# Altium project Archim_0.4.PrjPcb (part 1 of 3)
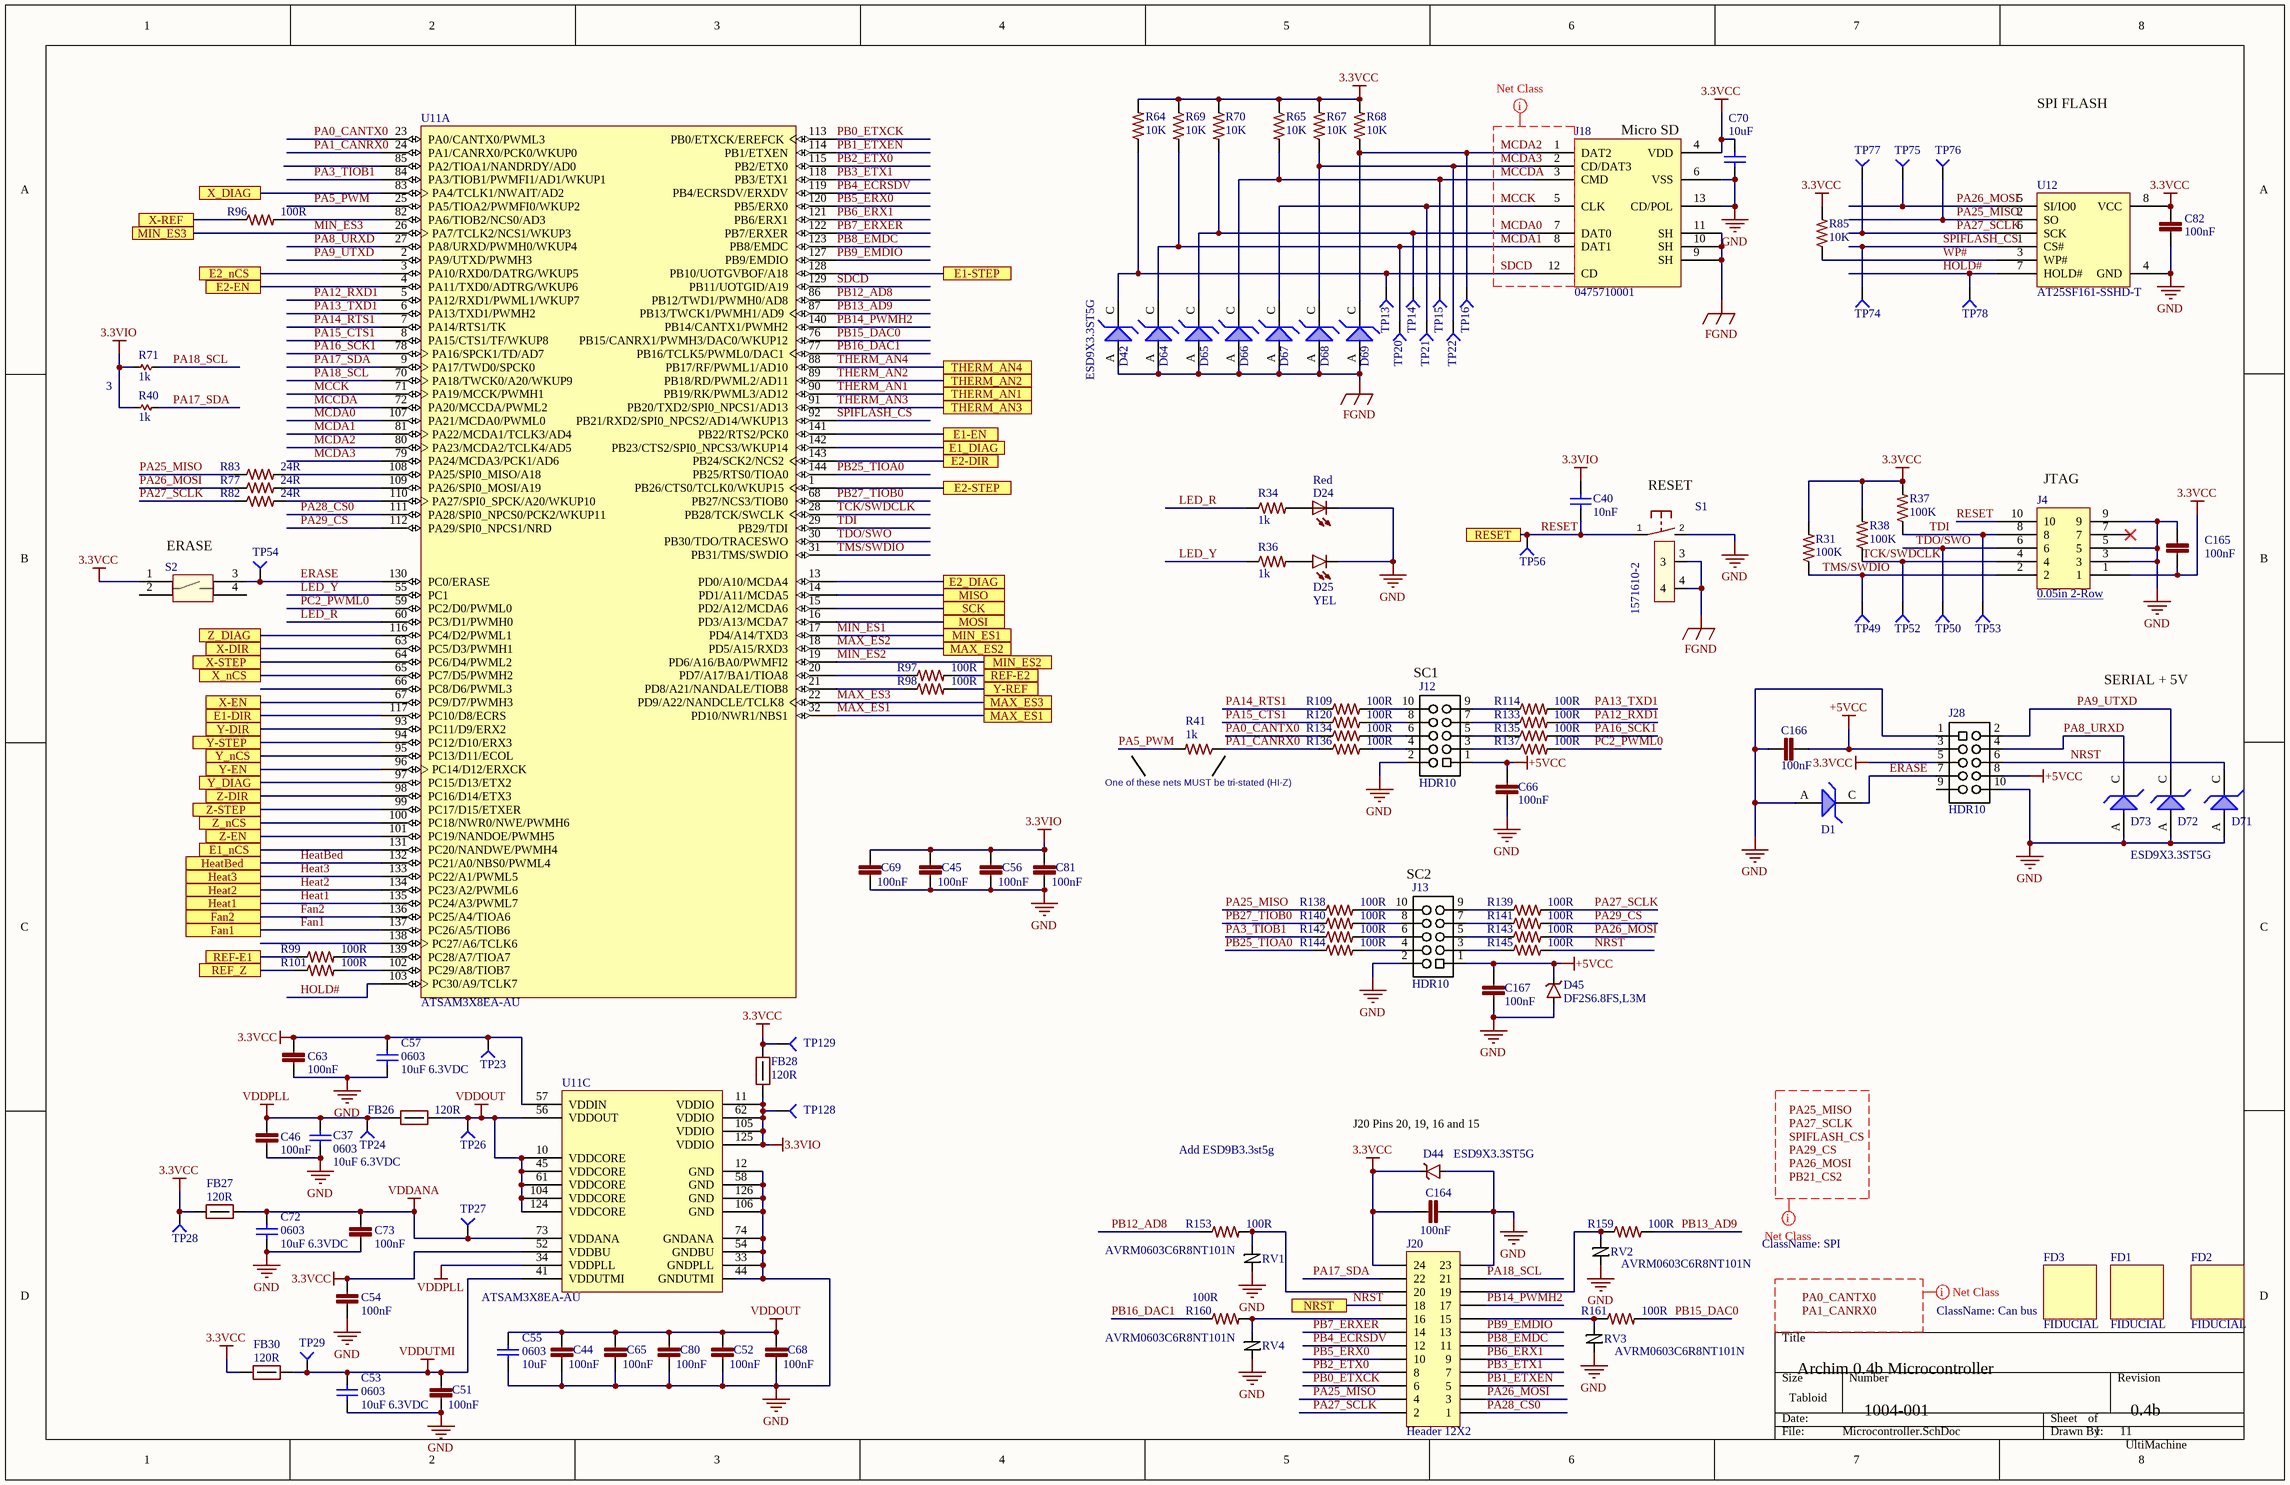
[diagram p0: Microcontroller.SchDoc]
projectDesigner: UltiMachine; projectDocumentNumber: 1004-001; projectDocumentRevision: 0.4b; projectTitle: Archim; projectVersion: 0.4b
11 sheets, 690 parts. Net scope: flat (ports and power ports of the same name join across sheets).
Board file: Archim.PcbDoc
Sheets:
  Microcontroller.SchDoc
  Power.SchDoc
  USB.SchDoc
  EndStops.SchDoc
  Motor-X.SchDoc
  Motor-Y.SchDoc
  Motor-Z.SchDoc
  Motor-E1.SchDoc
  Motor-E2.SchDoc
  Thermistors.SchDoc
  Mosfets.SchDoc

## Sheet Microcontroller.SchDoc: Microcontroller
size Tabloid; DocumentNumber: 1; Revision: 0.4b; SheetNumber: 1; SheetTotal: 11

### Parts
(Parts that share a designator on the sheet are numbered #1, #2 ... from top to bottom, then left to right.)
C37  0603  value 10uF 6.3VDC  [C0603]
C40  10nF  [C0402]
C44  100nF  [C0402]
C45  100nF  [C0402]
C46  100nF  [C0402]
C51  100nF  [C0402]
C52  100nF  [C0402]
C53  0603  value 10uF 6.3VDC  [C0603]
C54  100nF  [C0402]
C55  0603  value 10uF  [C0603]
C56  100nF  [C0402]
C57  0603  value 10uF 6.3VDC  [C0603]
C63  100nF  [C0402]
C65  100nF  [C0402]
C66  100nF  [C0402]
C68  100nF  [C0402]
C69  100nF  [C0402]
C70  value 10uF  [C0603]  (hidden comment: 0603)
C72  0603  value 10uF 6.3VDC  [C0603]
C73  100nF  [C0402]
C80  100nF  [C0402]
C81  100nF  [C0402]
C82  100nF  [C0402]
C164  100nF  [C0402]
C165  100nF  [C0402]
C166  100nF  [C0402]
C167  100nF  [C0402]
D1  ESD9X3.3ST5G  [SOD923-100X40-2N]  (value not drawn)
D24  Red  [LED2012120]
D25  YEL  [LED2012120]
D42  ESD9X3.3ST5G  [SOD923-100X40-2N]
D44  ESD9X3.3ST5G  [SOD923-D]
D45  DF2S6.8FS,L3M  [SOD923-D]
D64  ESD9X3.3ST5G  [SOD923-100X40-2N]  (value not drawn)
D65  ESD9X3.3ST5G  [SOD923-100X40-2N]  (value not drawn)
D66  ESD9X3.3ST5G  [SOD923-100X40-2N]  (value not drawn)
D67  ESD9X3.3ST5G  [SOD923-100X40-2N]  (value not drawn)
D68  ESD9X3.3ST5G  [SOD923-100X40-2N]  (value not drawn)
D69  ESD9X3.3ST5G  [SOD923-100X40-2N]  (value not drawn)
D71  ESD9X3.3ST5G  [SOD923-100X40-2N]
D72  ESD9X3.3ST5G  [SOD923-100X40-2N]  (value not drawn)
D73  ESD9X3.3ST5G  [SOD923-100X40-2N]  (value not drawn)
FB26  120R  [FB0603]
FB27  120R  [FB0603]
FB28  120R  [FB0603]
FB30  120R  [FB0603]
FD1  FIDUCIAL  [FIDUCIAL-1X2]
FD2  FIDUCIAL  [FIDUCIAL-1X2]
FD3  FIDUCIAL  [FIDUCIAL-1X2]
J4  0.05in 2-Row  [FTSH-105-XX-X-DV]
J12  HDR10  [HDR2X5 IDC]
J13  HDR10  [HDR2X5 IDC]
J18  0475710001  [SD_MICRO 475710001]
J20  Header 12X2  [HDR2X12]
J28  HDR10  [HDR2X5 IDC]
R31  100K  [R0402]
R34  1k  [R0402]
R36  1k  [R0402]
R37  100K  [R0402]
R38  100K  [R0402]
R40  1k  [R0402]
R41  1k  [R0402]
R64  10K  [R0402]
R65  10K  [R0402]
R67  10K  [R0402]
R68  10K  [R0402]
R69  10K  [R0402]
R70  10K  [R0402]
R71  1k  [R0402]
R77  24R  [R0402]
R82  24R  [R0402]
R83  24R  [R0402]
R85  10K  [R0402]
R96  100R  [R0402]
R97  100R  [R0402]
R98  100R  [R0402]
R99  100R  [R0402]
R101  100R  [R0402]
R109  100R  [R0402]
R114  100R  [R0402]
R120  100R  [R0402]
R133  100R  [R0402]
R134  100R  [R0402]
R135  100R  [R0402]
R136  100R  [R0402]
R137  100R  [R0402]
R138  100R  [R0402]
R139  100R  [R0402]
R140  100R  [R0402]
R141  100R  [R0402]
R142  100R  [R0402]
R143  100R  [R0402]
R144  100R  [R0402]
R145  100R  [R0402]
R153  100R  [R0402]
R159  100R  [R0402]
R160  100R  [R0402]
R161  100R  [R0402]
RV1  AVRM0603C6R8NT101N  [C0201 Large Pads]
RV2  AVRM0603C6R8NT101N  [C0201 Large Pads]
RV3  AVRM0603C6R8NT101N  [C0201 Large Pads]
RV4  AVRM0603C6R8NT101N  [C0201 Large Pads]
S1  1571610-2  [B3F-31XX]
S2  KMR741NG ULC LFS  [KMR 6 Series]  (value not drawn)
TP13  TP4  [TP-2]  (value not drawn)  (no BOM)
TP14  TP4  [TP-2]  (value not drawn)  (no BOM)
TP15  TP4  [TP-2]  (value not drawn)  (no BOM)
TP16  TP4  [TP-2]  (value not drawn)  (no BOM)
TP20  TP4  [TP-2]  (value not drawn)  (no BOM)
TP21  TP4  [TP-2]  (value not drawn)  (no BOM)
TP22  TP4  [TP-2]  (value not drawn)  (no BOM)
TP23  TP4  [TP-2]  (value not drawn)  (no BOM)
TP24  TP4  [TP-2]  (value not drawn)  (no BOM)
TP26  TP4  [TP-2]  (value not drawn)  (no BOM)
TP27  TP4  [TP-2]  (value not drawn)  (no BOM)
TP28  TP4  [TP-2]  (value not drawn)  (no BOM)
TP29  TP4  [TP-2]  (value not drawn)  (no BOM)
TP49  TP4  [TP-2]  (value not drawn)  (no BOM)
TP50  TP4  [TP-2]  (value not drawn)  (no BOM)
TP52  TP4  [TP-2]  (value not drawn)  (no BOM)
TP53  TP4  [TP-2]  (value not drawn)  (no BOM)
TP54  TP4  [TP-2]  (value not drawn)  (no BOM)
TP56  TP4  [TP-2]  (value not drawn)  (no BOM)
TP74  TP4  [TP-2]  (value not drawn)  (no BOM)
TP75  TP4  [TP-2]  (value not drawn)  (no BOM)
TP76  TP4  [TP-2]  (value not drawn)  (no BOM)
TP77  TP4  [TP-2]  (value not drawn)  (no BOM)
TP78  TP4  [TP-2]  (value not drawn)  (no BOM)
TP128  TP4  [TP-2]  (value not drawn)  (no BOM)
TP129  TP4  [TP-2]  (value not drawn)  (no BOM)
U11#1  ATSAM3X8EA-AU  [LQFP144_N]  (part A of 3)
U11#2  ATSAM3X8EA-AU  [LQFP144_N]  (part C of 3)
U12  AT25SF161-SSHD-T  [S25FL216K0PMFI041]

### Ports
E1-DIR, E1-EN, E1-STEP, E1_DIAG, E1_nCS, E2-DIR, E2-EN, E2-STEP, E2_DIAG, E2_nCS, Fan1, Fan2, Heat1, Heat2, Heat3, HeatBed, MAX_ES1, MAX_ES2, MAX_ES3, MIN_ES1, MIN_ES2, MIN_ES3, MISO, MOSI, NRST, REF-E1, REF-E2, REF_Z, RESET, SCK, THERM_AN1, THERM_AN2, THERM_AN3, THERM_AN4, X-DIR, X-EN, X-REF, X-STEP, X_DIAG, X_nCS, Y-DIR, Y-EN, Y-REF, Y-STEP, Y_DIAG, Y_nCS, Z-DIR, Z-EN, Z-STEP, Z_DIAG, Z_nCS

### Nets
3.3VCC: C54.1 C57.2 C63.1 C70.2 C82.1 C164.1 C165.2 D44.K FB27.1 FB28.2 FB30.1 J4.1 J18.4(VDD) J20.24 J28.5 R31.2 R37.2 R38.2 R64.2 R65.1 R67.2 R68.2 R69.1 R70.1 R85.2 S2.1 TP23.1 TP28.1 TP129.1 U11#2.52(VDDBU) U11#2.57(VDDIN) U12.8(VCC)
3.3VIO: C40.2 C45.1 C56.1 C69.1 C81.1 FB28.1 R40.1 R71.1 TP128.1 U11#2.11(VDDIO) U11#2.62(VDDIO) U11#2.105(VDDIO) U11#2.125(VDDIO)
+5VCC: C66.2 C166.1 C167.2 D45.K J12.1 J13.1 J28.3 J28.8
FGND: D42.A D64.A D65.A D66.A D67.A D68.A D69.A J18.9(SH) J18.10(SH) J18.11(SH) S1.3 S1.4
GND: C37.1 C44.2 C45.2 C46.2 C51.2 C52.2 C53.1 C54.2 C55.1 C56.2 C57.1 C63.2 C65.2 C66.1 C68.2 C69.2 C70.1 C72.1 C73.2 C80.2 C81.2 C82.2 C164.2 C165.1 C166.2 C167.1 D1.A D24.C D25.C D44.A D45.A D71.A D72.A D73.A J4.3 J4.5 J4.9 J12.2 J13.2 J18.6(VSS) J18.13(CD/POL) J20.23 J28.1 J28.10 RV1.2 RV2.2 RV3.2 RV4.2 S1.2(S) U11#2.12(GND) U11#2.33(GNDPLL) U11#2.44(GNDUTMI) U11#2.54(GNDBU) U11#2.58(GND) U11#2.74(GNDANA) U11#2.106(GND) U11#2.126(GND) U12.4(GND)
VDDANA: C72.2 C73.1 FB27.2 TP27.1 U11#2.73(VDDANA)
VDDOUT: C44.1 C52.1 C55.2 C65.1 C68.1 C80.1 FB26.2 TP26.1 U11#2.10(VDDCORE) U11#2.45(VDDCORE) U11#2.56(VDDOUT) U11#2.61(VDDCORE) U11#2.104(VDDCORE) U11#2.124(VDDCORE)
VDDPLL: C37.2 C46.1 FB26.1 TP24.1 U11#2.34(VDDPLL)
VDDUTMI: C51.1 C53.2 FB30.2 TP29.1 U11#2.41(VDDUTMI)
E1-DIR: U11#1.117(PC10/D8/ECRS) ; port E1-DIR
E1-EN: U11#1.141(PB22/RTS2/PCK0) ; port E1-EN
E1-STEP: U11#1.128(PB10/UOTGVBOF/A18) ; port E1-STEP
E1_DIAG: U11#1.142(PB23/CTS2/SPI0_NPCS3/WKUP14) ; port E1_DIAG
E1_nCS: U11#1.131(PC20/NANDWE/PWMH4) ; port E1_nCS
E2-DIR: U11#1.143(PB24/SCK2/NCS2) ; port E2-DIR
E2-EN: U11#1.4(PA11/TXD0/ADTRG/WKUP6) ; port E2-EN
E2-STEP: U11#1.1(PB26/CTS0/TCLK0/WKUP15) ; port E2-STEP
E2_DIAG: U11#1.13(PD0/A10/MCDA4) ; port E2_DIAG
E2_nCS: U11#1.3(PA10/RXD0/DATRG/WKUP5) ; port E2_nCS
ERASE: D1.C J28.7 S2.3 TP54.1 U11#1.130(PC0/ERASE)
Fan1: U11#1.137(PC26/A5/TIOB6) ; port Fan1
Fan2: U11#1.136(PC25/A4/TIOA6) ; port Fan2
Heat1: U11#1.135(PC24/A3/PWML7) ; port Heat1
Heat2: U11#1.134(PC23/A2/PWML6) ; port Heat2
Heat3: U11#1.133(PC22/A1/PWML5) ; port Heat3
HeatBed: U11#1.132(PC21/A0/NBS0/PWML4) ; port HeatBed
HOLD#: TP78.1 U11#1.103(PC30/A9/TCLK7) U12.7(HOLD#)
LED_R: R34.1 U11#1.60(PC3/D1/PWMH0)
LED_Y: R36.1 U11#1.55(PC1)
MAX_ES1: U11#1.32(PD10/NWR1/NBS1) ; port MAX_ES1
MAX_ES2: U11#1.18(PD5/A15/RXD3) ; port MAX_ES2
MAX_ES3: U11#1.22(PD9/A22/NANDCLE/TCLK8) ; port MAX_ES3
MCCDA: D66.C J18.3(CMD) R65.2 TP15.1 U11#1.72(PA20/MCCDA/PWML2)
MCCK: D67.C J18.5(CLK) TP21.1 U11#1.71(PA19/MCCK/PWMH1)
MCDA0: D65.C J18.7(DAT0) R70.2 TP14.1 U11#1.107(PA21/MCDA0/PWML0)
MCDA1: D64.C J18.8(DAT1) R69.2 TP20.1 U11#1.81(PA22/MCDA1/TCLK3/AD4)
MCDA2: D69.C J18.1(DAT2) R68.1 TP16.1 U11#1.80(PA23/MCDA2/TCLK4/AD5)
MCDA3: D68.C J18.2(CD/DAT3) R67.1 TP22.1 U11#1.79(PA24/MCDA3/PCK1/AD6)
MIN_ES1: U11#1.17(PD4/A14/TXD3) ; port MIN_ES1
MIN_ES2: U11#1.19(PD6/A16/BA0/PWMFI2) ; port MIN_ES2
MIN_ES3: U11#1.26(PA7/TCLK2/NCS1/WKUP3) ; port MIN_ES3
MISO: U11#1.14(PD1/A11/MCDA5) ; port MISO
MOSI: U11#1.16(PD3/A13/MCDA7) ; port MOSI
NRST: D71.C J20.18 J28.6 R145.2 ; port NRST
PA0_CANTX0: R134.1 U11#1.23(PA0/CANTX0/PWML3)
PA1_CANRX0: R41.1 R136.1 U11#1.24(PA1/CANRX0/PCK0/WKUP0)
PA3_TIOB1: R142.1 U11#1.84(PA3/TIOB1/PWMFI1/AD1/WKUP1)
PA5_PWM: R41.2 U11#1.25(PA5/TIOA2/PWMFI0/WKUP2)
PA8_URXD: D73.C J28.4 U11#1.27(PA8/URXD/PWMH0/WKUP4)
PA9_UTXD: D72.C J28.2 U11#1.2(PA9/UTXD/PWMH3)
PA12_RXD1: R133.2 U11#1.5(PA12/RXD1/PWML1/WKUP7)
PA13_TXD1: R114.2 U11#1.6(PA13/TXD1/PWMH2)
PA14_RTS1: R109.1 U11#1.7(PA14/RTS1/TK)
PA15_CTS1: R120.1 U11#1.8(PA15/CTS1/TF/WKUP8)
PA16_SCK1: R135.2 U11#1.78(PA16/SPCK1/TD/AD7)
PA17_SDA: J20.22 R40.2 U11#1.9(PA17/TWD0/SPCK0)
PA18_SCL: J20.21 R71.2 U11#1.70(PA18/TWCK0/A20/WKUP9)
PA25_MISO: J20.4 R83.1 R138.1 TP76.1 U12.2(SO)
PA26_MOSI: J20.3 R77.1 R143.2 TP75.1 U12.5(SI/IO0)
PA27_SCLK: J20.2 R82.1 R139.2 TP77.1 U12.6(SCK)
PA28_CS0: J20.1 U11#1.111(PA28/SPI0_NPCS0/PCK2/WKUP11)
PA29_CS: R141.2 U11#1.112(PA29/SPI0_NPCS1/NRD)
PB0_ETXCK: J20.6 U11#1.113(PB0/ETXCK/EREFCK)
PB1_ETXEN: J20.5 U11#1.114(PB1/ETXEN)
PB2_ETX0: J20.8 U11#1.115(PB2/ETX0)
PB3_ETX1: J20.7 U11#1.118(PB3/ETX1)
PB4_ECRSDV: J20.12 U11#1.119(PB4/ECRSDV/ERXDV)
PB5_ERX0: J20.10 U11#1.120(PB5/ERX0)
PB6_ERX1: J20.9 U11#1.121(PB6/ERX1)
PB7_ERXER: J20.14 U11#1.122(PB7/ERXER)
PB8_EMDC: J20.11 U11#1.123(PB8/EMDC)
PB9_EMDIO: J20.13 U11#1.127(PB9/EMDIO)
PB12_AD8: R153.1 U11#1.86(PB12/TWD1/PWMH0/AD8)
PB13_AD9: R159.2 U11#1.87(PB13/TWCK1/PWMH1/AD9)
PB14_PWMH2: J20.17 U11#1.140(PB14/CANTX1/PWMH2)
PB15_DAC0: R161.2 U11#1.76(PB15/CANRX1/PWMH3/DAC0/WKUP12)
PB16_DAC1: R160.1 U11#1.77(PB16/TCLK5/PWML0/DAC1)
PB25_TIOA0: R144.1 U11#1.144(PB25/RTS0/TIOA0)
PB27_TIOB0: R140.1 U11#1.68(PB27/NCS3/TIOB0)
PC2_PWML0: R137.2 U11#1.59(PC2/D0/PWML0)
REF-E1: R99.1 ; port REF-E1
REF-E2: R97.2 ; port REF-E2
REF_Z: R101.1 ; port REF_Z
RESET: C40.1 J4.10 S1.1(P) TP56.1 ; port RESET
SCK: U11#1.15(PD2/A12/MCDA6) ; port SCK
SDCD: D42.C J18.12(CD) R64.1 TP13.1 U11#1.129(PB11/UOTGID/A19)
SPIFLASH_CS: TP74.1 U11#1.92(PB21/RXD2/SPI0_NPCS2/AD14/WKUP13) U12.1(CS#)
TCK/SWDCLK: J4.4 R38.1 TP52.1 U11#1.28(PB28/TCK/SWCLK)
TDI: J4.8 R37.1 TP53.1 U11#1.29(PB29/TDI)
TDO/SWO: J4.6 TP50.1 U11#1.30(PB30/TDO/TRACESWO)
THERM_AN1: U11#1.90(PB19/RK/PWML3/AD12) ; port THERM_AN1
THERM_AN2: U11#1.89(PB18/RD/PWML2/AD11) ; port THERM_AN2
THERM_AN3: U11#1.91(PB20/TXD2/SPI0_NPCS1/AD13) ; port THERM_AN3
THERM_AN4: U11#1.88(PB17/RF/PWML1/AD10) ; port THERM_AN4
TMS/SWDIO: J4.2 R31.1 TP49.1 U11#1.31(PB31/TMS/SWDIO)
WP#: R85.1 U12.3(WP#)
X-DIR: U11#1.63(PC5/D3/PWMH1) ; port X-DIR
X-EN: U11#1.67(PC9/D7/PWMH3) ; port X-EN
X-REF: R96.1 ; port X-REF
X-STEP: U11#1.64(PC6/D4/PWML2) ; port X-STEP
X_DIAG: U11#1.83(PA4/TCLK1/NWAIT/AD2) ; port X_DIAG
X_nCS: U11#1.65(PC7/D5/PWMH2) ; port X_nCS
Y-DIR: U11#1.93(PC11/D9/ERX2) ; port Y-DIR
Y-EN: U11#1.96(PC14/D12/ERXCK) ; port Y-EN
Y-REF: R98.2 ; port Y-REF
Y-STEP: U11#1.94(PC12/D10/ERX3) ; port Y-STEP
Y_DIAG: U11#1.97(PC15/D13/ETX2) ; port Y_DIAG
Y_nCS: U11#1.95(PC13/D11/ECOL) ; port Y_nCS
Z-DIR: U11#1.98(PC16/D14/ETX3) ; port Z-DIR
Z-EN: U11#1.101(PC19/NANDOE/PWMH5) ; port Z-EN
Z-STEP: U11#1.99(PC17/D15/ETXER) ; port Z-STEP
Z_DIAG: U11#1.116(PC4/D2/PWML1) ; port Z_DIAG
Z_nCS: U11#1.100(PC18/NWR0/NWE/PWMH6) ; port Z_nCS
NetD24_A: D24.A R34.2
NetD25_A: D25.A R36.2
NetJ12_3: J12.3 R137.1
NetJ12_4: J12.4 R136.2
NetJ12_5: J12.5 R135.1
NetJ12_6: J12.6 R134.2
NetJ12_7: J12.7 R133.1
NetJ12_8: J12.8 R120.2
NetJ12_9: J12.9 R114.1
NetJ12_10: J12.10 R109.2
NetJ13_3: J13.3 R145.1
NetJ13_4: J13.4 R144.2
NetJ13_5: J13.5 R143.1
NetJ13_6: J13.6 R142.2
NetJ13_7: J13.7 R141.1
NetJ13_8: J13.8 R140.2
NetJ13_9: J13.9 R139.1
NetJ13_10: J13.10 R138.2
NetJ20_15: J20.15 R161.1 RV3.1
NetJ20_16: J20.16 R160.2 RV4.1
NetJ20_19: J20.19 R159.1 RV2.1
NetJ20_20: J20.20 R153.2 RV1.1
NetR77_2: R77.2 U11#1.109(PA26/SPI0_MOSI/A19)
NetR82_2: R82.2 U11#1.110(PA27/SPI0_SPCK/A20/WKUP10)
NetR83_2: R83.2 U11#1.108(PA25/SPI0_MISO/A18)
NetR96_2: R96.2 U11#1.82(PA6/TIOB2/NCS0/AD3)
NetR97_1: R97.1 U11#1.20(PD7/A17/BA1/TIOA8)
NetR98_1: R98.1 U11#1.21(PD8/A21/NANDALE/TIOB8)
NetR99_2: R99.2 U11#1.139(PC28/A7/TIOA7)
NetR101_2: R101.2 U11#1.102(PC29/A8/TIOB7)

Not connected (* = marked no-connect by the designer): J4 7*; J28 9; S2 2 4; U11#1 66(PC8/D6/PWML3) 85(PA2/TIOA1/NANDRDY/AD0) 138(PC27/A6/TCLK6)

### Layout directives
net class SD: MCCDA, MCCK, MCDA0, MCDA1, MCDA2, MCDA3, SDCD
net class Can bus: PA0_CANTX0, PA1_CANRX0
net class SPI: PA25_MISO, PA26_MOSI, PA27_SCLK, PA29_CS, PB21_CS2, SPIFLASH_CS

### Notes on the sheet
- (near J18) Micro SD
- SPI FLASH
- 3
- (near S1) RESET
- (near J4) JTAG
- (near S2) ERASE
- (near J12) SC1
- SERIAL + 5V
- One of these nets MUST be tri-stated (HI-Z)
- (near J13) SC2
- Add ESD9B3.3st5g
- (near D44) J20 Pins 20, 19, 16 and 15
- Labels drawn without touching a wire or pin: PA0_CANTX0, PA1_CANRX0, PA25_MISO, PA26_MOSI, PA27_SCLK, PA29_CS, PB21_CS2, SPIFLASH_CS

### Library data of the parts
C37 C53 C55 C57 C70 C72 = C1608JB0J106K080AB: CAP CER 10UF 6.3V 10% JB 0603; MANUFACTURER: TDK; PART: 10µF ±10% 6.3V Ceramic Capacitor JB 0603 (1608 Metric); EE_SPEC: 6.3VDC; PART DESCRIPTION: CAP CER 10UF 6.3V 10% JB 0603; TOLERANCE: 10%; MANUFACTURER #: C1608JB0J106K080AB; DISTRIBUTOR #: 445-11185-1-ND; DISTRIBUTOR: Digi-Key Electronics
C40 = GRM155R71H103JA88D: CAP CER 10nF 50V X7R 0402; PART DESCRIPTION: 10000pF ±5% 50V Ceramic Capacitor X7R 0402 (1005 Metric); MANUFACTURER: Murata; TOLERANCE: 5%; EE_SPEC: 50V; VALUE: 10nF; MANUFACTURER #: GRM155R71H103JA88D; DISTRIBUTOR #: 490-7763-1-ND; DISTRIBUTOR: Digi-Key Electronics; PART: 10nF 50V X7R 0402
C44-C46 C51 C52 C54 C56 C63 C65 C66 C68 C69 C73 C80-C82 C164-C167 = GRM155R71C104KA88D: CAP CER 0402 100nF 16V 10% X7R; MANUFACTURER: Murata; PART: 0.1uF 16V X7R 0402; PART DESCRIPTION: 0.10µF ±10% 16V Ceramic Capacitor X7R 0402 (1005 Metric); EE_SPEC: 100nF 16V X7R 0402; VALUE: 100nF; MANUFACTURER #: GRM155R71C104KA88D; DISTRIBUTOR #: 490-3261-2-ND; DISTRIBUTOR: Digi-Key Electronics; TOLERANCE: 10%
D1 D42 D44 D64-D69 D71-D73 = ESD9X3.3ST5G: TVS DIODE 3.3VWM 10.4VC SOD923; MANUFACTURER: On Semi; PART: TVS DIODE 3.3VWM SOD923; TOLERANCE: -NA-; VALUE: 3.3V; EE_SPEC: 3.3Vso 15pF; MANUFACTURER #: ESD9X3.3ST5G; DISTRIBUTOR #: ESD9X3.3ST5GOSCT-ND; PART DESCRIPTION: TVS DIODE 3.3VWM SOD923
  D1 D42 D64-D69 D71-D73: DISTRIBUTOR: Digi-Key Electronics
  D44: DISTRIBUTOR: Digikey
D24 = 5988110107F: LED 0805 Red; MANUFACTURER: Dialight; PART: LED Red 0805; PART DESCRIPTION: Red 635nm LED Indication - Discrete 2.2V 0805 (2012 Metric); TOLERANCE: -NA-; EE_SPEC: Vf=2.2V; VALUE: Red; MANUFACTURER #: 5988110107F; DISTRIBUTOR #: 350-2038-2-ND; DISTRIBUTOR: Digi-Key Electronics
D25 = 5988140107F: LED 0805 Yellow; MANUFACTURER: Dialight; PART: LED Yellow 0805; PART DESCRIPTION: Yellow 593nm LED Indication - Discrete 2V 0805 (2012 Metric); TOLERANCE: -NA-; EE_SPEC: Vf=2V; VALUE: YEL; MANUFACTURER #: 5988140107F; DISTRIBUTOR #: 350-2041-2-ND; DISTRIBUTOR: Digi-Key Electronics
D45 = DF2S6.8FS,L3M: TVS DIODE 5V 9V SOD923; MANUFACTURER: Toshiba; EE_SPEC: 5Vso; MANUFACTURER #: DF2S6.8FS,L3M; PART DESCRIPTION: TVS DIODE 5V 9V SOD923; VALUE: 5V
FB26-FB28 FB30 = FERRITE 120R 3A 0603: FERRITE BEAD 120 OHM 0603 1LN; MANUFACTURER: Samsung; MANUFACTURER #: CIS10P121AC; MANUFACTURER2#: 490-5254-2-ND; VALUE: 120Rfb; TOLERANCE: -NA-; EE_SPEC: 3A; DISTRIBUTOR #: 1276-6351-2-ND; DISTRIBUTOR: Digi-Key Electronics; PART: FERRITE 120R 3A 0603; PART DESCRIPTION: FERRITE BEAD 120 OHM 0603 1LN
FD1-FD3 = FIDUCIAL: MANUFACTURER #: NOTAPART-Fiducial
J4 = ARM Cortex JTAG-DEBUG Header: 20021121-00010C4LF; MANUFACTURER: Amphenol FCI; PART: 10 Pin Conn 2Row SMT; PART DESCRIPTION: 10 Positions Header, Unshrouded Connector 0.050" (1.27mm) Surface Mount Gold; TOLERANCE: -NA-; VALUE: HDR10; MANUFACTURER #: 20021121-00010C4LF; DISTRIBUTOR #: 609-3695-2-ND; DISTRIBUTOR: Digi-Key Electronics; EE_SPEC: -NA-
J12 J13 J28 = Header 10PIN 2ROW T-HOLE VERT SHROUDED: CONN HEADER VERT 10POS GOLD; MANUFACTURER #: 302-S101; MANUFACTURER: On Shore; PART DESCRIPTION: 10 Positions Header Connector 0.100" (2.54mm) Through Hole Gold; TOLERANCE: -NA-; DISTRIBUTOR #: ED1543-ND; DISTRIBUTOR: Digikey; PART: HDR10; VALUE: HDR10; EE_SPEC: -NA-
J18 = 0475710001: microSD 0475710001Molex Part; MANUFACTURER: Molex; PART: CONN Micro SD; PART DESCRIPTION: 10 (8 + 2) Position Card Connector Secure Digital - microSD™ Surface Mount, Right Angle Gold; TOLERANCE: -NA-; VALUE: SD Conn; MANUFACTURER #: 0475710001; DISTRIBUTOR #: WM9731TR-ND; DISTRIBUTOR: Digikey; EE_SPEC: -NA-
J20 = Header 12X2: Header, 12-Pin, Dual row; MANUFACTURER #: 2213S-24G; MANUFACTURER: Multicomp; PART: CONN 24Pin 2Row 0.1"; PART DESCRIPTION: Board-To-Board Connector, 2.54 mm, 24 Contacts, Header, 2213S Series, Through Hole, 2 Rows; TOLERANCE: -NA-; VALUE: HDR24; DISTRIBUTOR #: 08N6796; DISTRIBUTOR: Future; EE_SPEC: -NA-
R31 R37 R38 = RC1005F104CS: RES SMD 100K OHM 1% 1/16W 0402; MANUFACTURER: Samsung; PART: 100k 1% 0402; PART DESCRIPTION: 100k Ohm ±1% 0.063W, 1/16W Chip Resistor 0402 (1005 Metric) Moisture Resistant Thick Film; VALUE: 100K; MANUFACTURER #: RC1005F104CS; DISTRIBUTOR #: 1276-3432-1-ND; DISTRIBUTOR: Digi-Key Electronics; TOLERANCE: 1%; EE_SPEC: 1/16W
R34 R36 R41 = RK73H1ETTP1001F: RES 0402 1k 63mW 1%; MANUFACTURER: Yageo; MANUFACTURER #: RC0402FR-071KL; PART: 1k 1% 0402; PART DESCRIPTION: 1k Ohm ±1% 0.063W, 1/16W Chip Resistor 0402 (1005 Metric) Moisture Resistant Thick Film; EE_SPEC: 1/16W; VALUE: 1k; DISTRIBUTOR #: 311-1.00KLRTR-ND; DISTRIBUTOR: Digi-Key Electronics; TOLERANCE: 1%
R40 R71 = 1k 1% 0402: RES 0402 1k 63mW 1%; MANUFACTURER: Yageo; MANUFACTURER #: RC0402FR-071KL; PART DESCRIPTION: 1k Ohm ±1% 0.063W, 1/16W Chip Resistor 0402 (1005 Metric) Moisture Resistant Thick Film; EE_SPEC: 1/16W; DISTRIBUTOR #: 311-1.00KLRTR-ND; DISTRIBUTOR: Digi-Key Electronics; PART: 1k 1% 0402; TOLERANCE: 1%; VALUE: 1k
R64 R65 R67-R70 R85 = RC0402FR-0710KP: RES SMD 10K OHM 1% 1/16W 0402; MANUFACTURER: Yageo; PART: 10k 1% 0402; PART DESCRIPTION: 10k Ohm ±1% 0.063W, 1/16W Chip Resistor 0402 (1005 Metric) Moisture Resistant Thick Film; VALUE: 10K; MANUFACTURER #: RC0402FR-0710KP; DISTRIBUTOR #: YAG1249TR-ND; DISTRIBUTOR: Digi-Key Electronics; TOLERANCE: 1%; EE_SPEC: 1/16W
R77 R82 R83 = CRCW040224R0FKED: Res Thick Film 0402 24 Ohm 1% 0.063W; MANUFACTURER: Yageo; MANUFACTURER #: RC0402FR-0724RL; PART: 24R 1% 0402; PART DESCRIPTION: 24 Ohm ±1% 0.063W, 1/16W Chip Resistor 0402 (1005 Metric) Moisture Resistant Thick Film; EE_SPEC: 1/16W; VALUE: 24R; DISTRIBUTOR #: YAG3073TR-ND; DISTRIBUTOR: Digi-Key Electronics; TOLERANCE: 1%
R96-R99 R101 R109 R114 R120 R133-R145 R153 R159-R161 = RES 100R 0402 1%: RES SMD 100 OHM 1% 1/16W 0402; MANUFACTURER: Yageo; MANUFACTURER #: RC0402FR-07100RL; PART: 100R 1% 0402; PART DESCRIPTION: 100 Ohm ±1% 0.063W, 1/16W Chip Resistor 0402 (1005 Metric) Moisture Resistant Thick Film; VALUE: 100R; DISTRIBUTOR #: 311-100LRTR-ND; DISTRIBUTOR: Digi-Key Electronics; TOLERANCE: 1%; EE_SPEC: 1/16W
RV1-RV4 = AVRM0603C6R8NT101N: VARISTOR 6.8V 10A 0201; MANUFACTURER: TDK; TOLERANCE: -NA-; EE_SPEC: 3.5Vso 100pF; MANUFACTURER #: AVRM0603C6R8NT101N; PART DESCRIPTION: VARISTOR 6.8V 10A 0201; VALUE: 6.8V
S1 = 1571610-2: SWTCH Momentary Washable; MANUFACTURER: TE; PART: Tactile Pushbutton; PART DESCRIPTION: Tactile Switches R/A SEALED TACT SWITCH; TOLERANCE: -NA-; VALUE: -NA-; EE_SPEC: 24V; MANUFACTURER #: 1571610-2; DISTRIBUTOR #: 506-1571610-2; DISTRIBUTOR: Mouser
S2 = KMR741NG ULC LFS: SWITCH TACTILE SPST-NO 0.05A 12V; MANUFACTURER: C&K; PART: Tactile Pushbutton SMT; PART DESCRIPTION: Tactile Switch SPST-NO Top Actuated Surface Mount; TOLERANCE: -NA-; VALUE: -NA-; EE_SPEC: 32V 50mA; MANUFACTURER #: KMR741NG ULC LFS; DISTRIBUTOR #: CKN10688TR-ND; DISTRIBUTOR: Digi-Key Electronics
TP13-TP16 TP20-TP24 TP26-TP29 TP49 TP50 TP52-TP54 TP56 TP74-TP78 TP128 TP129 = Socket: MANUFACTURER #: NOTAPART-Testpoint
U11#1 U11#2 = ATML-ATSAM3X-LQFP-144: Atmel; PART: IC MCU 32BIT 512KB FLASH 144LQFP; PART DESCRIPTION: ARM® Cortex®-M3 SAM3X Microcontroller IC 32-Bit 84MHz 512KB (512K x 8) FLASH 144-LQFP (20x20); TOLERANCE: -NA-; VALUE: -NA-; EE_SPEC: 3.3V; MANUFACTURER #: ATSAM3X8EA-AU; MANUFACTURER: Atmel; DISTRIBUTOR #: ATSAM3X8EA-AU-ND; DISTRIBUTOR: Digi-Key Electronics
U12 = AT25SF161-SSHD-T: IC FLASH 16M SPI 104MHZ 8SOIC; MANUFACTURER: Adesto; TOLERANCE: -NA-; VALUE: 16Mb; EE_SPEC: 3.3V; MANUFACTURER #: AT25SF161-SSHD-T; PART DESCRIPTION: IC FLASH 16M SPI 104MHZ 8SOIC

## Sheet Power.SchDoc: Power
size Letter; DocumentNumber: 8; SheetNumber: 2; SheetTotal: 11
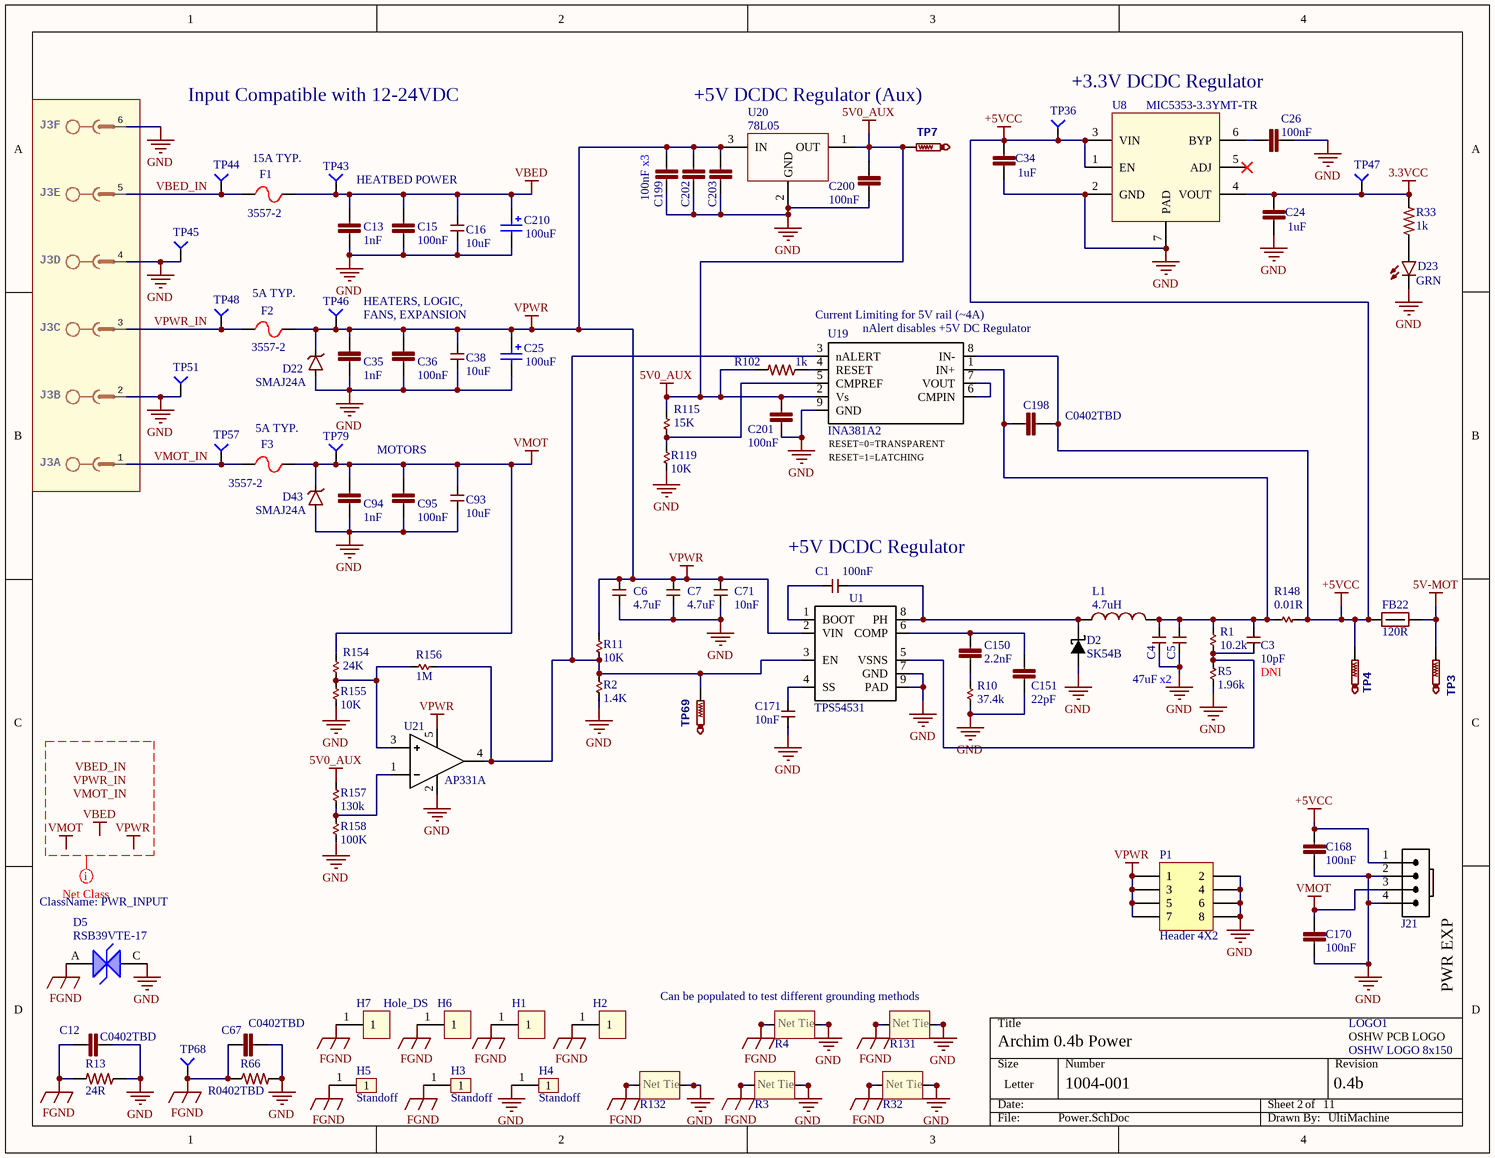
[diagram p1: Power.SchDoc]

### Parts
C1  100nF  [C0603]
C3  10pF  [C0402]
C4  47uF  [C1210]
C5  47uF  [C1210]  (value not drawn)
C6  4.7uF  [C1210]
C7  4.7uF  [C1210]
C12  C0402TBD  [C0402]
C13  1nF  [C0402]
C15  100nF  [C0603]
C16  10uF  [C1206]
C24  1uF  [C0402]
C25  value 100uF  [CAP-ELEC-063063077]  (hidden comment: UWT1V101MCL1GS)
C26  100nF  [C0402]
C34  1uF  [C0402]
C35  1nF  [C0402]
C36  100nF  [C0603]
C38  10uF  [C1206]
C67  C0402TBD  [C0402]
C71  10nF  [C0402]
C93  10uF  [C1206]
C94  1nF  [C0402]
C95  100nF  [C0603]
C150  2.2nF  [C0402]
C151  22pF  [C0402]
C168  100nF  [C0402]
C170  100nF  [C0402]
C171  10nF  [C0402]
C198  C0402TBD  [C0402]
C199  100nF  [C0603]
C200  100nF  [C0402]
C201  100nF  [C0402]
C202  100nF  [C0603]  (value not drawn)
C203  100nF  [C0603]  (value not drawn)
C210  value 100uF  [CAP-ELEC-063063077]  (hidden comment: UWT1V101MCL1GS)
D2  SK54B  [SMB_DO-214AA_LRG]
D5  RSB39VTE-17  [SOD323-R]
D22  SMAJ24A  [SMA-SM]
D23  GRN  [LED2012120]
D43  SMAJ24A  [SMA-SM]
F1  3557-2  [3557]
F2  3557-2  [3557]
F3  3557-2  [3557]
FB22  120R  [FB0603]
H1  Hole_DS  [Wave_hole_3x7-doubleSided]  (value not drawn)  (no BOM)
H2  Hole_DS  [Wave_hole_3x7-doubleSided]  (value not drawn)  (no BOM)
H3  Standoff  [Standoff3mmTopConn]  (no BOM)
H4  Standoff  [Standoff3mmTopConn]  (no BOM)
H5  Standoff  [Standoff3mmTopConn]  (no BOM)
H6  Hole_DS  [Wave_hole_3x7-doubleSided]  (value not drawn)  (no BOM)
H7  Hole_DS  [Wave_hole_3x7-doubleSided]  (no BOM)
J3  MSTBH6  [MSTBH6]  (value not drawn)  (parts A,B,C,D,E,F of 6)
J21  Molex 0705430038  [4POL254 PIN-IN-PASTE]  (value not drawn)
L1  4.7uH  [IND_10X10]
LOGO1  OSHW LOGO 8x150  [OSHW_8X150_NOTEXT]  (no BOM)
P1  Header 4X2  [HDR2X4]
R1  10.2k  [R0402]
R2  1.4K  [R0402]
R3  Net-Tie 0402  [Net Tie - R0402]  (value not drawn)  (net tie)
R4  Net-Tie 0402  [Net Tie - R0402]  (value not drawn)  (net tie)
R5  1.96k  [R0402]
R10  37.4k  [R0402]
R11  10K  [R0402]
R13  24R  [R0402]
R32  Net-Tie 0402  [Net Tie - R0402]  (value not drawn)  (net tie)
R33  1k  [R0402]
R66  R0402TBD  [R0402]
R102  1k  [R0402]
R115  15K  [R0402]
R119  10K  [R0402]
R131  Net-Tie 0402  [Net Tie - R0402]  (value not drawn)  (net tie)
R132  Net-Tie 0402  [Net Tie - R0402]  (value not drawn)  (net tie)
R148  0.01R  [R0805]
R154  24K  [R0402]
R155  10K  [R0402]
R156  1M  [R0402]
R157  130k  [R0402]
R158  100K  [R0402]
TP3  TestPoint  [TP1-27]  (value not drawn)  (no BOM)
TP4  TestPoint  [TP1-27]  (value not drawn)  (no BOM)
TP7  TestPoint  [TP1-27]  (value not drawn)  (no BOM)
TP36  TP4  [TP-2]  (value not drawn)  (no BOM)
TP43  TP4  [TP-2]  (value not drawn)  (no BOM)
TP44  TP4  [TP-2]  (value not drawn)  (no BOM)
TP45  TP4  [TP-2]  (value not drawn)  (no BOM)
TP46  TP4  [TP-2]  (value not drawn)  (no BOM)
TP47  TP4  [TP-2]  (value not drawn)  (no BOM)
TP48  TP4  [TP-2]  (value not drawn)  (no BOM)
TP51  TP4  [TP-2]  (value not drawn)  (no BOM)
TP57  TP4  [TP-2]  (value not drawn)  (no BOM)
TP68  TP4  [TP-2]  (value not drawn)  (no BOM)
TP69  TestPoint  [TP1-27]  (value not drawn)  (no BOM)
TP79  TP4  [TP-2]  (value not drawn)  (no BOM)
U1  TPS54531  [SOIC127P600X170_HS-9L]
U8  MIC5353-3.3YMT-TR  [TDFN1616-6LD-PL-1]
U19  INA381A2  [WSON8_2x2mm]
U20  78L05  [SOT-89-3]
U21  AP331A  [SOT23-5]

### Nets
3.3VCC: C24.1 R33.2 TP47.1 U8.4(VOUT)
5V0_AUX: C200.2 C201.2 R102.2 R115.2 R157.2 TP7.TP U19.2(Vs) U20.1(OUT)
5V-MOT: FB22.2 TP3.TP
+5VCC: C34.1 C168.2 C198.1 FB22.1 J21.1 R148.2 TP4.TP TP36.1 U8.1(EN) U8.3(VIN) U19.8(IN-)
FGND: C12.1 C67.1 D5.A H1.1 H2.1 H3.1 H5.1 H6.1 H7.1 R3.1 R4.1 R13.2 R32.1 R66.1 R131.1 R132.1 TP68.1
GND: C4.1 C5.1 C6.1 C7.1 C12.2 C13.2 C15.2 C16.1 C24.2 C25.2 C26.2 C34.2 C35.2 C36.2 C38.1 C67.2 C71.1 C93.1 C94.2 C95.2 C151.1 C168.1 C170.1 C171.1 C199.2 C200.1 C201.1 C202.2 C203.2 C210.2 D2.A(ANODE) D5.C D22.A D23.C D43.A H4.1 J3.2 J3.4 J3.6 J21.2 J21.4 P1.2 P1.4 P1.6 P1.8 R2.1 R3.2 R4.2 R5.1 R10.1 R13.1 R32.2 R66.2 R119.1 R131.2 R132.2 R155.1 R158.1 TP45.1 TP51.1 U1.7(GND) U1.9(PAD) U8.2(GND) U8.7(PAD) U19.9(GND) U20.2(GND) U21.2(GND)
VBED: C13.1 C15.1 C16.2 C210.1 F1.2 TP43.1
VMOT: C93.2 C94.1 C95.1 C170.2 D43.K F3.2 J21.3 R154.1 TP79.1
VPWR: C6.2 C7.2 C25.1 C35.1 C36.1 C38.2 C71.2 C199.1 C202.1 C203.1 D22.K F2.2 P1.1 P1.3 P1.5 P1.7 R11.2 TP46.1 U1.2(VIN) U20.3(IN) U21.5(VCC)
VBED_IN: F1.1 J3.5 TP44.1
VMOT_IN: F3.1 J3.1 TP57.1
VPWR_IN: F2.1 J3.3 TP48.1
NetC1_1: C1.1 U1.1(BOOT)
NetC1_2: C1.2 D2.K(CATHODE) L1.1 U1.8(PH)
NetC3_1: C3.1 R1.2 R5.2 U1.5(VSNS)
NetC3_2: C3.2 C4.2 C5.2 C198.2 L1.2 R1.1 R148.1 U19.1(IN+)
NetC26_1: C26.1 U8.6(BYP)
NetC150_1: C150.1 R10.2
NetC150_2: C150.2 C151.2 U1.6(COMP)
NetC171_2: C171.2 U1.4(SS)
NetD23_A: D23.A R33.1
NetR2_2: R2.2 R11.1 R156.1 TP69.TP U1.3(EN) U19.3(nALERT) U21.4(OUT)
NetR102_1: R102.1 U19.4(RESET)
NetR115_1: R115.1 R119.2 U19.5(CMPREF)
NetR154_2: R154.2 R155.2 R156.2 U21.3(IN+)
NetR157_1: R157.1 R158.2 U21.1(IN-)
NetU19_6: U19.6(CMPIN) U19.7(VOUT)

Not connected (* = marked no-connect by the designer): U8 5(ADJ)*

### Layout directives
net class PWR_INPUT: VBED, VBED_IN, VMOT, VMOT_IN, VPWR, VPWR_IN

### Notes on the sheet
- Input Compatible with 12-24VDC
- +5V DCDC Regulator (Aux)
- +3.3V DCDC Regulator
- 15A TYP.
- (near C199) x3
- HEATBED POWER
- 5A TYP.
- FANS, EXPANSION
- HEATERS, LOGIC,
- Current Limiting for 5V rail (~4A)
- (near U19) nAlert disables +5V DC Regulator
- MOTORS
- RESET=1=LATCHING
- (near U19) RESET=0=TRANSPARENT
- (near C1) +5V DCDC Regulator
- x2
- (near J21) PWR EXP
- Can be populated to test different grounding methods
- Labels drawn without touching a wire or pin: VBED, VBED_IN, VMOT, VMOT_IN, VPWR, VPWR_IN
- (in symbol Net-Tie 0402) Net Tie
- (in symbol OSHW LOGO 8x150) OSHW PCB LOGO

### Library data of the parts
C1 = 100nF 0603 50V X7R: CAP CER 0603 100nF 50V 10% X7R; MANUFACTURER: Kemet; MANUFACTURER #: C0603C104K5RACTU; PART DESCRIPTION: 0.1µF ±10% 50V Ceramic Capacitor X7R 0603 (1608 Metric); TOLERANCE: +/- 10%; EE_SPEC: 100nF 50V X7R 0603; DISTRIBUTOR #: 399-5089-2-ND; DISTRIBUTOR: Digi-Key; PART: 100nF; VALUE: 100nF
C3 = 10pF 0402 50V NP0: CAP CER 10PF 50V 5% NP0 0402; PART DESCRIPTION: 10pF ±5% 50V Ceramic Capacitor C0G, NP0 0402 (1005 Metric); MANUFACTURER #: CL05C100JB5NNNC; MANUFACTURER: Samsung; PART: 10pF 50V NP0 0402; TOLERANCE: 5%; EE_SPEC: 50V; DISTRIBUTOR #: 1276-1139-2-ND; DISTRIBUTOR: Digikey; DNI: DNI; VALUE: 10pF
C4 C5 = 47uF 1210 10V X5R: CAP CER 47UF 10V X5R 1210; MANUFACTURER: Murata; MANUFACTURER #: GRM32ER61A476KE20L; PART DESCRIPTION: 47µF ±10% 10V Ceramic Capacitor X5R 1210 (3225 Metric); TOLERANCE: 10%; EE_SPEC: 10V, 3mOhm; DISTRIBUTOR #: 490-3887-1-ND; DISTRIBUTOR: Digikey; PART: 47uF; VALUE: 47uF
C6 C7 = 4.7uF 1210 50V X7R: CAP CER 4.7UF 50V X7R 1210; MANUFACTURER: Murata; MANUFACTURER #: GRM32ER71H475KA88L; PART DESCRIPTION: 4.7µF ±10% 50V Ceramic Capacitor X7R 1210 (3225 Metric); TOLERANCE: 10%; DISTRIBUTOR #: 490-1864-1-ND; DISTRIBUTOR: Digikey; PART: 4.7uF 1210 50V X7R; EE_SPEC: 50V; VALUE: 4.7uF
C12 C67 C198 = C0402TBD: Capacitor Non Polarized; MANUFACTURER #: DNI-C0402TBD; VALUE: C0402TBD; DNI: DNI
C13 C35 C94 = CAP 1nF 50V 0402 X7R: 1000pF 50V Ceramic Capacitor X7R 0402 (1005 Metric) 0.039" L x 0.020" W (1.00mm x 0.50mm); MANUFACTURER: Murata; MANUFACTURER #: GRM155R71H102KA01D; PART: 1nF 50V X7R 0402; PART DESCRIPTION: 1000pF ±10% 50V Ceramic Capacitor X7R 0402 (1005 Metric); TOLERANCE: 10%; VALUE: 1nF; DISTRIBUTOR #: 490-1303-2-ND; DISTRIBUTOR: Digi-Key Electronics; EE_SPEC: 50V
C15 C36 C95 = C0603C104K5RACTU: CAP CER 0603 100nF 50V 10% X7R; MANUFACTURER: Kemet; PART: 100nF 50V X7R 0603; PART DESCRIPTION: 0.10µF ±10% 50V Ceramic Capacitor X7R 0603 (1608 Metric); VALUE: 100nF; MANUFACTURER #: C0603C104K5RACTU; DISTRIBUTOR #: 399-5089-2-ND; DISTRIBUTOR: Digi-Key Electronics; TOLERANCE: 10%; EE_SPEC: 100nF 50V X7R 0603
C16 C38 C93 = 10uF 1206 50V X5R: CAP CER 10UF 50V 10% X5R 1206; MANUFACTURER: Murata; MANUFACTURER #: 490-10756-2-ND; PART: CAP CER 10UF 50V X5R 1206; PART DESCRIPTION: 10µF ±20% 50V Ceramic Capacitor X5R 1206 (3216 Metric); MANUFACTURER2#: 587-3248-2-ND; DISTRIBUTOR #: 490-10756-2-ND; DISTRIBUTOR: Digi-Key Electronics; TOLERANCE: 10%; EE_SPEC: 50V; VALUE: 10uF
C24 C34 = GRM155R60J105KE19D: CAP CER 0402 1uF 6.3V 10% X5R; MANUFACTURER: Murata; PART: 1uF 6.3V X5R 0402; PART DESCRIPTION: 1µF ±10% 6.3V Ceramic Capacitor X5R 0402 (1005 Metric); VALUE: 1uF; MANUFACTURER #: GRM155R60J105KE19D; DISTRIBUTOR #: 490-1320-2-ND; DISTRIBUTOR: Digi-Key Electronics; TOLERANCE: 10%; EE_SPEC: 1uF 6.3V X5R 0402
C25 C210 = UWT1V101MCL1GS: CAP ALUM 100UF 35V 20% SMD; MANUFACTURER: Nichicon; PART: 100uF 35V SMD Al-El; PART DESCRIPTION: 100µF 35V Aluminum Capacitors Radial, Can - SMD 1000 Hrs @ 105°C; EE_SPEC: 100uF 35V Al-El; MANUFACTURER #: UWT1V101MCL1GS; DISTRIBUTOR #: 493-2203-2-ND; DISTRIBUTOR: Digi-Key Electronics; TOLERANCE: 20%
C26 C168 C170 C200 C201 = GRM155R71C104KA88D: as C44 on sheet Microcontroller; VALUE: 100nF; MANUFACTURER #: GRM155R71C104KA88D; DISTRIBUTOR #: 490-3261-2-ND; DISTRIBUTOR: Digi-Key Electronics; TOLERANCE: 10%
C71 C171 = 10nF 0402 50V X7R: CAP CER 10nF 50V X7R 0402; PART DESCRIPTION: 10000pF ±5% 50V Ceramic Capacitor X7R 0402 (1005 Metric); MANUFACTURER #: GRM155R71H103JA88D; MANUFACTURER: Murata; TOLERANCE: 5%; EE_SPEC: 50V; DISTRIBUTOR #: 490-7763-1-ND; DISTRIBUTOR: Digikey; PART: 10nF 50V X7R 0402; VALUE: 10nF
C150 = 2.2nF 25V C0G 0402: CAP CER 0402 2.2nF 25V C0G; MANUFACTURER: Kemet; MANUFACTURER #: C0402C222J3GACTU; PART DESCRIPTION: 2200pF ±5% 25V Ceramic Capacitor C0G, NP0 0402 (1005 Metric); EE_SPEC: 25; TOLERANCE: 5%; VALUE: 2.2nF; DISTRIBUTOR #: 399-8957-2-ND; DISTRIBUTOR: Digikey; PART: 2.2nF 25V C0G 0402
C151 = 22pF 0402 50V C0G: CAP CER 0402 22pF 50V 5% C0G; Manufacturer: AVX; MANUFACTURER #: 04025A220JAT2A; Part Description: 22pF ±5% 50V Ceramic Capacitor C0G, NP0 0402 (1005 Metric); EE_SPEC: 22pF 5% 50V NP0 0402; VALUE: 22pF; DISTRIBUTOR #: 478-1074-2-ND; DISTRIBUTOR: Digi-Key; PART: 22pF 50V; Tolerance: 5%
C199 C202 C203 = C0603C104K5RACTU: CAP CER 0603 100nF 50V 10% X7R; Manufacturer: Kemet; Part Description: 0.1µF ±10% 50V Ceramic Capacitor X7R 0603 (1608 Metric); EE_SPEC: 100nF 50V X7R 0603; VALUE: 100nF; MANUFACTURER #: C0603C104K5RACTU; DISTRIBUTOR #: 399-5089-2-ND; DISTRIBUTOR: Digi-Key Electronics; PART: 100nF 50V X7R 0603; Tolerance: 10%
D2 = SK54B: DIODE SCHOTTKY 40V 5A SMB_DO214AA; MANUFACTURER: MCC; MANUFACTURER #: SK54B-LTP; VOLTAGE: 40Vrb; PART: SK54B; DISTRIBUTOR: DIGI-KEY; DISTRIBUTOR #: SK54B-LTPMSTR-ND
D5 = RSB39VTE-17: DIODE TVS; MANUFACTURER: Rohm; PART: TVS DIODE 30VWM SOD323; TOLERANCE: -NA-; VALUE: 30V; EE_SPEC: 30Vso 30pF; MANUFACTURER #: RSB39VTE-17; DISTRIBUTOR #: RSB39VTE-17TR-ND; DISTRIBUTOR: Digi-Key Electronics; PART DESCRIPTION: TVS DIODE 30VWM SOD323
D22 D43 = SMAJ24A: TVS DIODE 24V 38.9V SMA; Manufacturer: Bourns Inc; EE_SPEC: 24Vrs 38.9Vc; MANUFACTURER #: SMAJ24A; DISTRIBUTOR #: SMAJ24ABTR-ND; DISTRIBUTOR: Digi-Key; Part Description: TVS DIODE 24V 38.9V SMA; VALUE: SMAJ24A
D23 = 5988170107F: LED 0805 Green; MANUFACTURER: Dialight; PART: LED GREEN CLEAR 0805 SMD; PART DESCRIPTION: Green 566nm LED Indication - Discrete 2V 0805 (2012 Metric); TOLERANCE: -NA-; EE_SPEC: Vf=2V; VALUE: GRN; MANUFACTURER #: 5988170107F; DISTRIBUTOR #: 350-2044-2-ND; DISTRIBUTOR: Digi-Key Electronics
F1-F3 = 3557-2: FUSE PTH ATO; MANUFACTURER: Keystone; PART: Fuse Holder; PART DESCRIPTION: Fuse Block 30A 500V 1 Circuit Blade PCB; TOLERANCE: -NA-; VALUE: -NA-; EE_SPEC: 500V; MANUFACTURER #: 3557-2; DISTRIBUTOR #: 36-3557-2-ND; DISTRIBUTOR: Digi-Key Electronics
FB22 = FERRITE 120R 3A 0603: as FB26 on sheet Microcontroller; DISTRIBUTOR #: 1276-6351-2-ND; DISTRIBUTOR: Digi-Key Electronics; PART: FERRITE 120R 3A 0603; PART DESCRIPTION: FERRITE BEAD 120 OHM 0603 1LN
H1 H2 H6 H7 = Hole_DS: MANUFACTURER #: NOTAPART-Hole
H3-H5 = Standoff3TopConn: Mechanical - Top connect; MANUFACTURER #: NOTAPART-Hole
J3 = MSTBH6: PHOENIX; MANUFACTURER: Molex; MANUFACTURER #: 39532-1006; PART: 6 Pin Conn RA; PART DESCRIPTION: 6 Position Terminal Block Header, Male Pins, Shrouded (4 Side) 0.200" (5.08mm) 90°, Right Angle Through Hole; TOLERANCE: -NA-; VALUE: HDR6; DISTRIBUTOR #: WM7849-ND; DISTRIBUTOR: Digi-Key Electronics; EE_SPEC: -NA-
J21 = Molex 0705430003 PIP: Molex 4 Pin Clip Connector - Pin In Paste footprint
L1 = 4.7uH 10A: FIXED IND 4.7UH 10A 15.5 MOHM; Manufacturer: Bourns; MANUFACTURER #: SRP1038A-4R7M; Part Description: 4.7µH Shielded Wirewound Inductor 10A 15.5 mOhm Max Nonstandard; EE_SPEC: Irms=10A, Isat=17A, DCR=0.016Ohms; Tolerance: +/- 20%; Value: 4.7uH; DISTRIBUTOR #: SRP1038A-4R7MTR-ND; DISTRIBUTOR: Digi-Key; PART: 4.7uH 10A
LOGO1 = OSHW LOGO 8x150: MANUFACTURER #: NOTAPART-OSHW LOGO
P1 = Header 4X2: Header, 4-Pin, Dual row; MANUFACTURER #: 2213S-08G; MANUFACTURER: Multicomp; PART: CONN 8Pin 2Row 0.1"; PART DESCRIPTION: Board-To-Board Connector, 2.54 mm, 8 Contacts, Header, 2213S Series, Through Hole, 2 Rows; TOLERANCE: -NA-; VALUE: HDR8; DISTRIBUTOR #: 08N6790; DISTRIBUTOR: Future; EE_SPEC: -NA-
R1 = 10.2k 1% 0402: RES SMD 10.2K OHM 1% 1/16W 0402; MANUFACTURER: Yageo; MANUFACTURER #: RC0402FR-0710K2L; PART DESCRIPTION: 10.2 kOhms ±1% 0.063W, 1/16W Chip Resistor 0402 (1005 Metric) Moisture Resistant Thick Film; DISTRIBUTOR #: YAG2950TR-ND; DISTRIBUTOR: Digikey; PART: 10.2k 1% 0402; TOLERANCE: 1%; EE_SPEC: 1/16W; VALUE: 10.2k
R2 = 1.4k 1% 0402: RES SMD 1.4K OHM 1% 1/16W 0402; MANUFACTURER: Stackpole; MANUFACTURER #: RMCF0402FT1K40; Part Description: 1.4 kOhms ±1% 0.063W, 1/16W Chip Resistor 0402 (1005 Metric) Automotive AEC-Q200 Thick Film; Tolerance: +/- 1%; EE_SPEC: 1.4k 1% 0402; VALUE: 1.4K
R5 = 1.96k 1% 0402: RES SMD 1.96K OHM 1% 1/16W 0402; MANUFACTURER: Yageo; MANUFACTURER #: RC0402FR-071K96L; PART DESCRIPTION: 1.96 kOhms ±1% 0.063W, 1/16W Chip Resistor 0402 (1005 Metric) Moisture Resistant Thick Film; VALUE: 1.96k; DISTRIBUTOR #: 311-1.96KLRTR-ND; DISTRIBUTOR: Digikey; EE_SPEC: 1/16W; PART: 1.96k 1% 0402; TOLERANCE: 1%
R10 = 37.4K 1% 0402: RES SMD 37.4K OHM 1% 1/16W 0402; MANUFACTURER: Yageo; MANUFACTURER #: RC0402FR-0737K4L; PART DESCRIPTION: 37.4 kOhms ±1% 0.063W, 1/16W Chip Resistor 0402 (1005 Metric) Moisture Resistant Thick Film; DISTRIBUTOR #: YAG3138CT-ND; DISTRIBUTOR: Digikey; PART: 37.4k; TOLERANCE: 1%; EE_SPEC: 1/16W; VALUE: 37.4k
R11 R119 R155 = 10k 1% 0402: RES SMD 10K OHM 1% 1/16W 0402; MANUFACTURER: Yageo; MANUFACTURER #: RC0402FR-0710KP; PART DESCRIPTION: 10k Ohm ±1% 0.063W, 1/16W Chip Resistor 0402 (1005 Metric) Moisture Resistant Thick Film; DISTRIBUTOR #: YAG1249TR-ND; DISTRIBUTOR: Digikey; PART: 10k 1% 0402; TOLERANCE: 1%; EE_SPEC: 1/16W; VALUE: 10K
R13 = CRCW040224R0FKED: as R77 on sheet Microcontroller; VALUE: 24R; DISTRIBUTOR #: YAG3073TR-ND; DISTRIBUTOR: Digi-Key Electronics; TOLERANCE: 1%
R33 R102 = RK73H1ETTP1001F: as R34 on sheet Microcontroller; VALUE: 1k; DISTRIBUTOR #: 311-1.00KLRTR-ND; DISTRIBUTOR: Digi-Key Electronics; TOLERANCE: 1%
R66 = R0402TBD: Resistor; MANUFACTURER #: DNI-R0402TBD; VALUE: R0402TBD; DNI: DNI
R115 = 15K 1% 0402: RES SMD 15K 1% 1/16W 0402; MANUFACTURER: Samsung; MANUFACTURER #: RC1005F153CS; PART DESCRIPTION: 15K Ohm ±1% 0.063W, 1/16W Chip Resistor 0402 (1005 Metric) Moisture Resistant Thick Film; DISTRIBUTOR #: 1276-3442-2-ND; DISTRIBUTOR: Digikey; PART: 15K 1% 0402; TOLERANCE: 1%; EE_SPEC: 1/16W; VALUE: 15K
R148 = 0.01R 1% 0805: RES 0.01 OHM 1% 1/2W 0805; MANUFACTURER: Susumu; MANUFACTURER #: KRL1220E-M-R010-F-T5; PART: 0.01 1% 0.5W 0805; PART DESCRIPTION: 10 mOhms ±1% 0.5W, 1/2W Chip Resistor 0805 (2012 Metric) Automotive AEC-Q200, Current Sense Metal Foil; EE_SPEC: 0.5W; DISTRIBUTOR #: 408-1544-2-ND; DISTRIBUTOR: Digikey; TOLERANCE: 1%; VALUE: 0.01R
R154 = 24k 1% 0402: RES SMD 24K OHM 1% 1/16W 0402; MANUFACTURER: Visha Dale; MANUFACTURER #: CRCW040224K0FKEDC; Part Description: 24 kOhms ±1% 0.063W, 1/16W Chip Resistor 0402 (1005 Metric)  Thick Film; Tolerance: +/- 1%; EE_SPEC: 24k 1% 0402; VALUE: 24K
R156 = 1M 5% 0402: RES 0402 1M 100mW 5%; MANUFACTURER: Panasonic; MANUFACTURER #: ERJ2GEJ105X; PART DESCRIPTION: 1M Ohm ±5% 0.1W, 1/10W Chip Resistor 0402 (1005 Metric) Automotive AEC-Q200 Thick Film; EE_SPEC: 1/10W; DISTRIBUTOR #: P1.0MJTR-ND; DISTRIBUTOR: Digikey; PART: 1M 5% 0402; TOLERANCE: 5%; VALUE: 1M
R157 = 130k 1% 0402: RES SMD 130K OHM 5% 1/16W 0402; MANUFACTURER: Yageo; MANUFACTURER #: RC0402JR-07130KL; PART DESCRIPTION: 130 kOhms ±5% 0.063W, 1/16W Chip Resistor 0402 (1005 Metric) Moisture Resistant Thick Film; TOLERANCE: 1%; DISTRIBUTOR #: YAG3273CT-ND; DISTRIBUTOR: Digikey; PART: 130k 1% 0402; EE_SPEC: 1/16W; VALUE: 130k
R158 = 100k 1% 0402: RES SMD 100K OHM 1% 1/16W 0402; MANUFACTURER: Samsung; MANUFACTURER #: RC1005F104CS; PART DESCRIPTION: 100k Ohm ±1% 0.063W, 1/16W Chip Resistor 0402 (1005 Metric) Moisture Resistant Thick Film; DISTRIBUTOR #: 1276-3432-1-ND; DISTRIBUTOR: Digikey; PART: 100k 1% 0402; TOLERANCE: 1%; EE_SPEC: 1/16W; VALUE: 100K
TP3 TP4 TP7 TP69 = TestPoint: Test Point
TP36 TP43-TP48 TP51 TP57 TP68 TP79 = Socket: MANUFACTURER #: NOTAPART-Testpoint
U1 = TPS54531: IC REG BUCK ADJ 5A 8SOPWRPAD; MANUFACTURER #: TPS54531DDAR; MANUFACTURER: TI; PART DESCRIPTION: Buck Switching Regulator IC Positive Adjustable 0.8V 1 Output 5A 8-PowerSOIC (0.154", 3.90mm Width); EE_SPEC: 28Vin_max, 5A, 570kHz; VALUE: TPS54531; DISTRIBUTOR #: 296-40801-2-ND; DISTRIBUTOR: Digikey; PART: TPS54531
U8 = MIC5353-3.3YMT-TR: LDO 3.3V 500mA - low ESR Cout; MANUFACTURER: Microchip; PART: IC REG LDO 3.3V 0.5A 6TMLF; PART DESCRIPTION: Linear Voltage Regulator IC Positive Fixed 1 Output 3.3V 500mA 6-TMLF® (1.6x1.6); TOLERANCE: -NA-; VALUE: 3.3V LDO; MANUFACTURER #: MIC5353-3.3YMT-TR; DISTRIBUTOR #: 576-3680-2-ND; DISTRIBUTOR: Digi-Key Electronics; EE_SPEC: 500mA
U19 = INA381_ALT: IC COMPARATOR BIDIR 8WSON; MANUFACTURER #: INA381A2IDSGR; MANUFACTURER: TI; TOLERANCE: -NA-; EE_SPEC: Vcc 2.7-5.5V; Vcm 26V; DISTRIBUTOR #: 296-49078-2-ND; DISTRIBUTOR: Digikey; PART: INA381A2; VALUE: INA381A2
U20 = 78L05: IC REG LINEAR 5V 100MA SOT89-3; MANUFACTURER #: L78L05ABUTR; MANUFACTURER: ST; PART DESCRIPTION: Linear Voltage Regulator IC Positive Fixed 1 Output 5V 100mA SOT-89-3; TOLERANCE: -NA-; VALUE: 5V LDO; EE_SPEC: Vin 30V, Iout 0.1A; DISTRIBUTOR #: 497-1181-2-ND; DISTRIBUTOR: Digikey; PART: IC REG LINEAR 5V 100MA SOT89-3
U21 = AP331A: IC QUAD DIFF COMPARATOR 14 -SOIC; MANUFACTURER: TEXAS INSTRUMENTS; MANUFACTURER #: AP331AWG-7; PART: AP331A; DISTRIBUTOR: DIGI-KEY; DISTRIBUTOR #: AP331AWGDITR-ND; VALUE: AP331A

## Sheet USB.SchDoc: USB
size Letter; DocumentNumber: 2; SheetNumber: 3; SheetTotal: 11
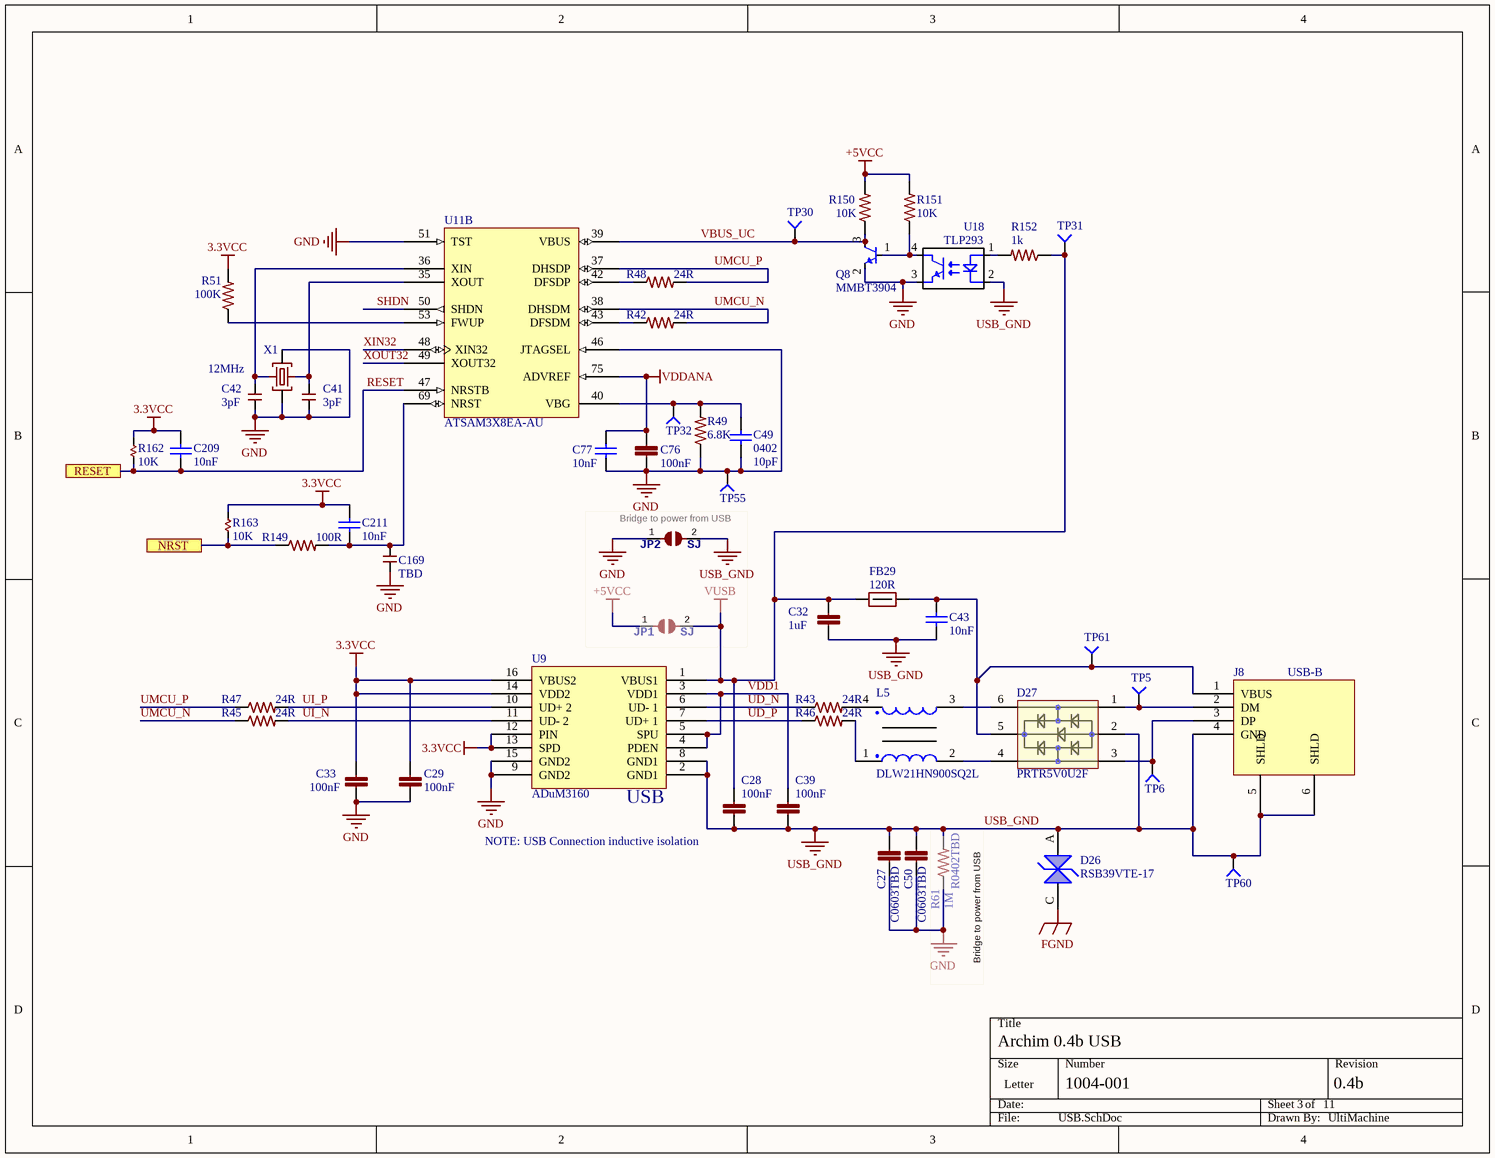
[diagram p2: USB.SchDoc]

### Parts
(Parts that share a designator on the sheet are numbered #1, #2 ... from top to bottom, then left to right.)
C27  C0603TBD  [C0603]
C28  100nF  [C0402]
C29  100nF  [C0402]
C32  1uF  [C0402]
C33  100nF  [C0402]
C39  100nF  [C0402]
C41  3pF  [C0603]
C42  3pF  [C0603]
C43  10nF  [C0402]
C49  0402  value 10pF  [C0402]
C50  C0603TBD  [C0603]
C76  100nF  [C0402]
C77  10nF  [C0402]
C169  TBD  [C0402]
C209  10nF  [C0402]
C211  10nF  [C0402]
D26  RSB39VTE-17  [SOD323-R]
D27  PRTR5V0U2F  [SOT886]
FB29  120R  [FB0603]
J8  USB-B  [PN61729]
JP1  SJ  [SJ]  (no BOM)
JP2  SJ  [SJ]  (no BOM)
L5  DLW21HN900SQ2L  [DLW21HN900SQ2L]
Q8  MMBT3904  [SOT523 SMALL]
R42  24R  [R0402]
R43  24R  [R0402]
R45  24R  [R0402]
R46  24R  [R0402]
R47  24R  [R0402]
R48  24R  [R0402]
R49  6.8K  [R0402]
R51  100K  [R0402]
R61  R0402TBD  value 1M  [R0402TBD]
R149  100R  [R0402]
R150  10K  [R0402]
R151  10K  [R0402]
R152  1k  [R0402]
R162  10K  [R0402]
R163  10K  [R0402]
TP5  TP4  [TP-2]  (value not drawn)  (no BOM)
TP6  TP4  [TP-2]  (value not drawn)  (no BOM)
TP30  TP4  [TP-2]  (value not drawn)  (no BOM)
TP31  TP4  [TP-2]  (value not drawn)  (no BOM)
TP32  TP4  [TP-2]  (value not drawn)  (no BOM)
TP55  TP4  [TP-2]  (value not drawn)  (no BOM)
TP60  TP4  [TP-2]  (value not drawn)  (no BOM)
TP61  TP4  [TP-2]  (value not drawn)  (no BOM)
U9  ADuM3160  [ADuM4160]
U11#2  ATSAM3X8EA-AU  [LQFP144_N]  (part B of 3)
U18  TLP293  [SO-4]
X1  12MHz  [CRYS320500]

### Blocks framed on the sheet
Bridge to power from USB: JP1 JP2

### Ports
NRST, RESET

### Nets
3.3VCC: C29.1 C33.1 C209.1 C211.1 R51.2 R162.2 R163.2 U9.12(PIN) U9.13(SPD) U9.14(VDD2) U9.16(VBUS2)
+5VCC: JP1.1 R150.2 R151.2
FGND: D26.C
GND: C27.2 C29.2 C33.2 C41.1 C42.1 C49.2 C50.2 C76.2 C77.2 C169.2 JP2.1 Q8.2(E) R49.1 R61.1 TP55.1 U9.9(GND2) U9.15(GND2) U11#2.46(JTAGSEL) U11#2.51(TST) U18.3(E) X1.2(GND) X1.4(GND)
USB_GND: C27.1 C28.2 C32.2 C39.2 C43.1 C50.1 D26.A D27.2 J8.4(GND) J8.5(SHLD) J8.6(SHLD) JP2.2 R61.2 TP60.1 U9.2(GND1) U9.8(GND1) U18.2(K)
VDDANA: C76.1 C77.1 U11#2.75(ADVREF)
VUSB: C28.1 C32.1 FB29.1 JP1.2 R152.1 TP31.1 U9.1(VBUS1)
NRST: R149.1 R163.1 ; port NRST
RESET: C209.2 R162.1 U11#2.47(NRSTB) ; port RESET
SHDN: U11#2.50(SHDN)
UD_N: R43.1 U9.6(UD-_1)
UD_P: R46.1 U9.7(UD+_1)
UI_N: R45.2 U9.11(UD-_2)
UI_P: R47.2 U9.10(UD+_2)
UMCU_N: R42.2 R45.1 U11#2.38(DHSDM)
UMCU_P: R47.1 R48.2 U11#2.37(DHSDP)
VBUS_UC: Q8.3(C) R150.1 TP30.1 U11#2.39(VBUS)
VDD1: C39.1 U9.3(VDD1) U9.4(PDEN) U9.5(SPU)
XIN32: U11#2.48(XIN32)
XOUT32: U11#2.49(XOUT32)
NetC41_2: C41.2 U11#2.35(XOUT) X1.3(C2)
NetC42_2: C42.2 U11#2.36(XIN) X1.1(C1)
NetC43_2: C43.2 D27.5 FB29.2 J8.1(VBUS) TP61.1
NetC49_1: C49.1 R49.2 TP32.1 U11#2.40(VBG)
NetC169_1: C169.1 C211.2 R149.2 U11#2.69(NRST)
NetD27_1: D27.1 J8.2(DM) TP5.1
NetD27_3: D27.3 J8.3(DP) TP6.1
NetD27_4: D27.4 L5.2
NetD27_6: D27.6 L5.3
NetL5_1: L5.1 R46.2
NetL5_4: L5.4 R43.2
NetQ8_1: Q8.1(B) R151.1 U18.4(C)
NetR42_1: R42.1 U11#2.43(DFSDM)
NetR48_1: R48.1 U11#2.42(DFSDP)
NetR51_1: R51.1 U11#2.53(FWUP)
NetR152_2: R152.2 U18.1(A)

### Notes on the sheet
- (near U9) USB
- (near C28) NOTE: USB Connection inductive isolation
- (near R61) Bridge to power from USB

### Library data of the parts
C27 C50 = C0603TBD: Capacitor Non Polarized; MANUFACTURER #: DNI-C0603TBD; VALUE: C0603TBD; DNI: DNI
C28 C29 C33 C39 C76 = GRM155R71C104KA88D: as C44 on sheet Microcontroller; VALUE: 100nF; MANUFACTURER #: GRM155R71C104KA88D; DISTRIBUTOR #: 490-3261-2-ND; DISTRIBUTOR: Digi-Key Electronics; TOLERANCE: 10%
C32 = GRM155R60J105KE19D: as C24 on sheet Power; VALUE: 1uF; MANUFACTURER #: GRM155R60J105KE19D; DISTRIBUTOR #: 490-1320-2-ND; DISTRIBUTOR: Digi-Key Electronics; TOLERANCE: 10%; EE_SPEC: 1uF 6.3V X5R 0402
C41 C42 = 3pF 0603 50V NP0: CAP CER 3PF 50V NP0 0603; MANUFACTURER: Samsung; MANUFACTURER #: CL10C030BB8NNNC; PART DESCRIPTION: 3pF ±0.1pF 50V Ceramic Capacitor C0G, NP0 0603 (1608 Metric); TOLERANCE: +/- 0.1pF; DISTRIBUTOR #: 1276-2125-2-ND; DISTRIBUTOR: Digi-Key Electronics; PART: 3pF 50V NP0 0603; EE_SPEC: 50V; VALUE: 3pF
C43 C77 C209 C211 = GRM155R71H103JA88D: as C40 on sheet Microcontroller; EE_SPEC: 50V; VALUE: 10nF; MANUFACTURER #: GRM155R71H103JA88D; DISTRIBUTOR #: 490-7763-1-ND; DISTRIBUTOR: Digi-Key Electronics; PART: 10nF 50V X7R 0402
C49 = CL05C100JB5NNNC: CAP CER 10PF 50V 5% NP0 0402; PART DESCRIPTION: 10pF ±5% 50V Ceramic Capacitor C0G, NP0 0402 (1005 Metric); MANUFACTURER: Samsung; PART: 10pF 50V NP0 0402; TOLERANCE: 5%; EE_SPEC: 50V; MANUFACTURER #: CL05C100JB5NNNC; DISTRIBUTOR #: 1276-1139-2-ND; DISTRIBUTOR: Digi-Key Electronics
C169 = C0402_TBD: CAP CER 0402 TBD; MANUFACTURER: TBD; VALUE: TBD; MANUFACTURER #: TBD; DISTRIBUTOR #: TBD; PART: TBD; PART DESCRIPTION: TBD; EE_SPEC: TBD
D26 = RSB39VTE-17: as D5 on sheet Power; MANUFACTURER #: RSB39VTE-17; DISTRIBUTOR #: RSB39VTE-17TR-ND; DISTRIBUTOR: Digi-Key Electronics; PART DESCRIPTION: TVS DIODE 30VWM SOD323
D27 = PRTR5V0U2F: Rail-to-rail ESD protection devices; MANUFACTURER #: PRTR5V0U2F,115; MANUFACTURER: NXP; PART: TVS Array, 2 Lines, Low Capacitance; PART DESCRIPTION: TVS DIODE 5.5VWM SOT886; TOLERANCE: -NA-; VALUE: 5.5V; EE_SPEC: 5.5Vso 1pF; DISTRIBUTOR #: 568-4677-2-ND; DISTRIBUTOR: Digi-Key Electronics
FB29 = FERRITE 120R 3A 0603: as FB26 on sheet Microcontroller; DISTRIBUTOR #: 1276-6351-2-ND; DISTRIBUTOR: Digi-Key Electronics; PART: FERRITE 120R 3A 0603; PART DESCRIPTION: FERRITE BEAD 120 OHM 0603 1LN
J8 = USB-B: MANUFACTURER #: 61729-0010BLF; MANUFACTURER: Amphenol FCI; PART: CONN RCPT USB TYPE B R/A PCB; PART DESCRIPTION: USB - B USB 2.0 Receptacle Connector 4 Position Through Hole, Right Angle; TOLERANCE: -NA-; VALUE: USB B; DISTRIBUTOR #: 609-1039-ND; DISTRIBUTOR: Digi-Key Electronics; EE_SPEC: -NA-
JP1 JP2 = SJ: SMD solder jumper; MANUFACTURER #: NOTAPART-Solder Bridge
L5 = DLW21HN900SQ2L: Common Mode Chokes Dual 90Ohm 100MHz 330mA 350mOhm DCR SMD; MANUFACTURER: Murata; PART: Choke Common-Mode 2LN 90 OHM SMD; PART DESCRIPTION: 2 Line Common Mode Choke Surface Mount 90 Ohm @ 100MHz 330mA DCR 350 mOhm; TOLERANCE: -NA-; VALUE: 90R; EE_SPEC: 50V 330mA 0.33Ohm; MANUFACTURER #: DLW21HN900SQ2L; DISTRIBUTOR #: 490-1064-2-ND; DISTRIBUTOR: Digi-Key Electronics
Q8 = MMBT3904_SOT523: TRANS NPN 60V 0.2A SOT523; MANUFACTURER #: MMBT3904T-7-F; MANUFACTURER: Diodes Incorporated; PART: TRANS NPN 40V 0.2A SOT523; PART DESCRIPTION: Bipolar (BJT) Transistor NPN 40V 200mA 300MHz 150mW Surface Mount SOT-523; TOLERANCE: -NA-; EE_SPEC: 40V 0.2A; DISTRIBUTOR #: MMBT3904T-FDITR-ND; DISTRIBUTOR: Digi-Key Electronics; VALUE: NPN
R42 R43 R45-R48 = CRCW040224R0FKED: as R77 on sheet Microcontroller; VALUE: 24R; DISTRIBUTOR #: YAG3073TR-ND; DISTRIBUTOR: Digi-Key Electronics; TOLERANCE: 1%
R49 = CRCW04026K80FKED: RES SMD 6.8K OHM 1% 1/16W 0402; MANUFACTURER: Vishay Dale; PART: 6.8k 1% 0402; PART DESCRIPTION: 6.8k Ohm ±1% 0.063W, 1/16W Chip Resistor 0402 (1005 Metric) Automotive AEC-Q200 Thick Film; VALUE: 6.8K; MANUFACTURER #: CRCW04026K80FKED; DISTRIBUTOR #: 541-6.80KLTR-ND; DISTRIBUTOR: Digi-Key Electronics; TOLERANCE: 1%; EE_SPEC: 1/16W
R51 = RC1005F104CS: as R31 on sheet Microcontroller; VALUE: 100K; MANUFACTURER #: RC1005F104CS; DISTRIBUTOR #: 1276-3432-1-ND; DISTRIBUTOR: Digi-Key Electronics; TOLERANCE: 1%; EE_SPEC: 1/16W
R61 = ERJ2GEJ105X: RES 0402 1M 100mW 5%; MANUFACTURER: Panasonic; PART: 1M 5% 0402; PART DESCRIPTION: 1M Ohm ±5% 0.1W, 1/10W Chip Resistor 0402 (1005 Metric) Automotive AEC-Q200 Thick Film; EE_SPEC: 1/10W; MANUFACTURER #: ERJ2GEJ105X; DISTRIBUTOR #: P1.0MJTR-ND; DISTRIBUTOR: Digi-Key Electronics; TOLERANCE: 5%; DNI: DNI
R149 = RES 100R 0402 1%: as R96 on sheet Microcontroller; VALUE: 100R; DISTRIBUTOR #: 311-100LRTR-ND; DISTRIBUTOR: Digi-Key Electronics; TOLERANCE: 1%; EE_SPEC: 1/16W
R150 R151 = RC0402FR-0710KP: as R64 on sheet Microcontroller; VALUE: 10K; MANUFACTURER #: RC0402FR-0710KP; DISTRIBUTOR #: YAG1249TR-ND; DISTRIBUTOR: Digi-Key Electronics; TOLERANCE: 1%; EE_SPEC: 1/16W
R152 = RK73H1ETTP1001F: as R34 on sheet Microcontroller; VALUE: 1k; DISTRIBUTOR #: 311-1.00KLRTR-ND; DISTRIBUTOR: Digi-Key Electronics; TOLERANCE: 1%
R162 R163 = 10k 1% 0402: as R11 on sheet Power; DISTRIBUTOR #: YAG1249TR-ND; DISTRIBUTOR: Digikey; PART: 10k 1% 0402; TOLERANCE: 1%; EE_SPEC: 1/16W; VALUE: 10K
TP5 TP6 TP30-TP32 TP55 TP60 TP61 = Socket: MANUFACTURER #: NOTAPART-Testpoint
U9 = ADuM4160: USB Opto Isolator; MANUFACTURER #: ADUM3160BRWZ-RL; MANUFACTURER: Analog Devices; PART: IC DGTL ISO 2.5KV 2CH USB 16SOIC; PART DESCRIPTION: USB Digital Isolator 2500Vrms 2 Channel 12Mbps 25kV/µs CMTI 16-SOIC (0.295", 7.50mm Width); TOLERANCE: -NA-; VALUE: USB ISO; EE_SPEC: 2500V ISO; DISTRIBUTOR #: ADUM3160BRWZ-RLTR-ND; DISTRIBUTOR: Digi-Key Electronics
U11#2 = ATML-ATSAM3X-LQFP-144: as U11#1 on sheet Microcontroller; MANUFACTURER #: ATSAM3X8EA-AU; MANUFACTURER: Atmel; DISTRIBUTOR #: ATSAM3X8EA-AU-ND; DISTRIBUTOR: Digi-Key Electronics
U18 = OPTO SO-4 OPNDRN OUT: Optoisolator Transistor Output 3750Vrms 1 Channel 4-SO; MANUFACTURER #: TLP293(TPL,E; MANUFACTURER: TOSHIBA; PART: Opto-Isolator 3.75kV; TOLERANCE: -NA-; VALUE: -NA-; EE_SPEC: 3.75kV Isolation; DISTRIBUTOR #: TLP293(TPLETR-ND; DISTRIBUTOR: Digi-Key Electronics; PART DESCRIPTION: Optoisolator Transistor Output 3750Vrms 1 Channel 4-SO
X1 = 405C35B12M00000: Crystal 12MHz ±30ppm (Tol) ±50ppm (Stability) 13pF FUND 50Ohm; MANUFACTURER: CTS; PART: 12MHz XTAL; PART DESCRIPTION: 12MHz ±30ppm Crystal 13pF 60 Ohm -20°C ~ 70°C Surface Mount 4-SMD, No Lead (DFN, LCC); TOLERANCE: +/- 30ppm; EE_SPEC: -NA-; MANUFACTURER #: 405C35B12M00000; DISTRIBUTOR #: CTX639TR-ND; DISTRIBUTOR: Digi-Key Electronics; VALUE: 12MHz